# EAGLE schematic SPU_Rev_1.0 (EAGLE 9.3.1)

## Sheet 1 of 4: MCU
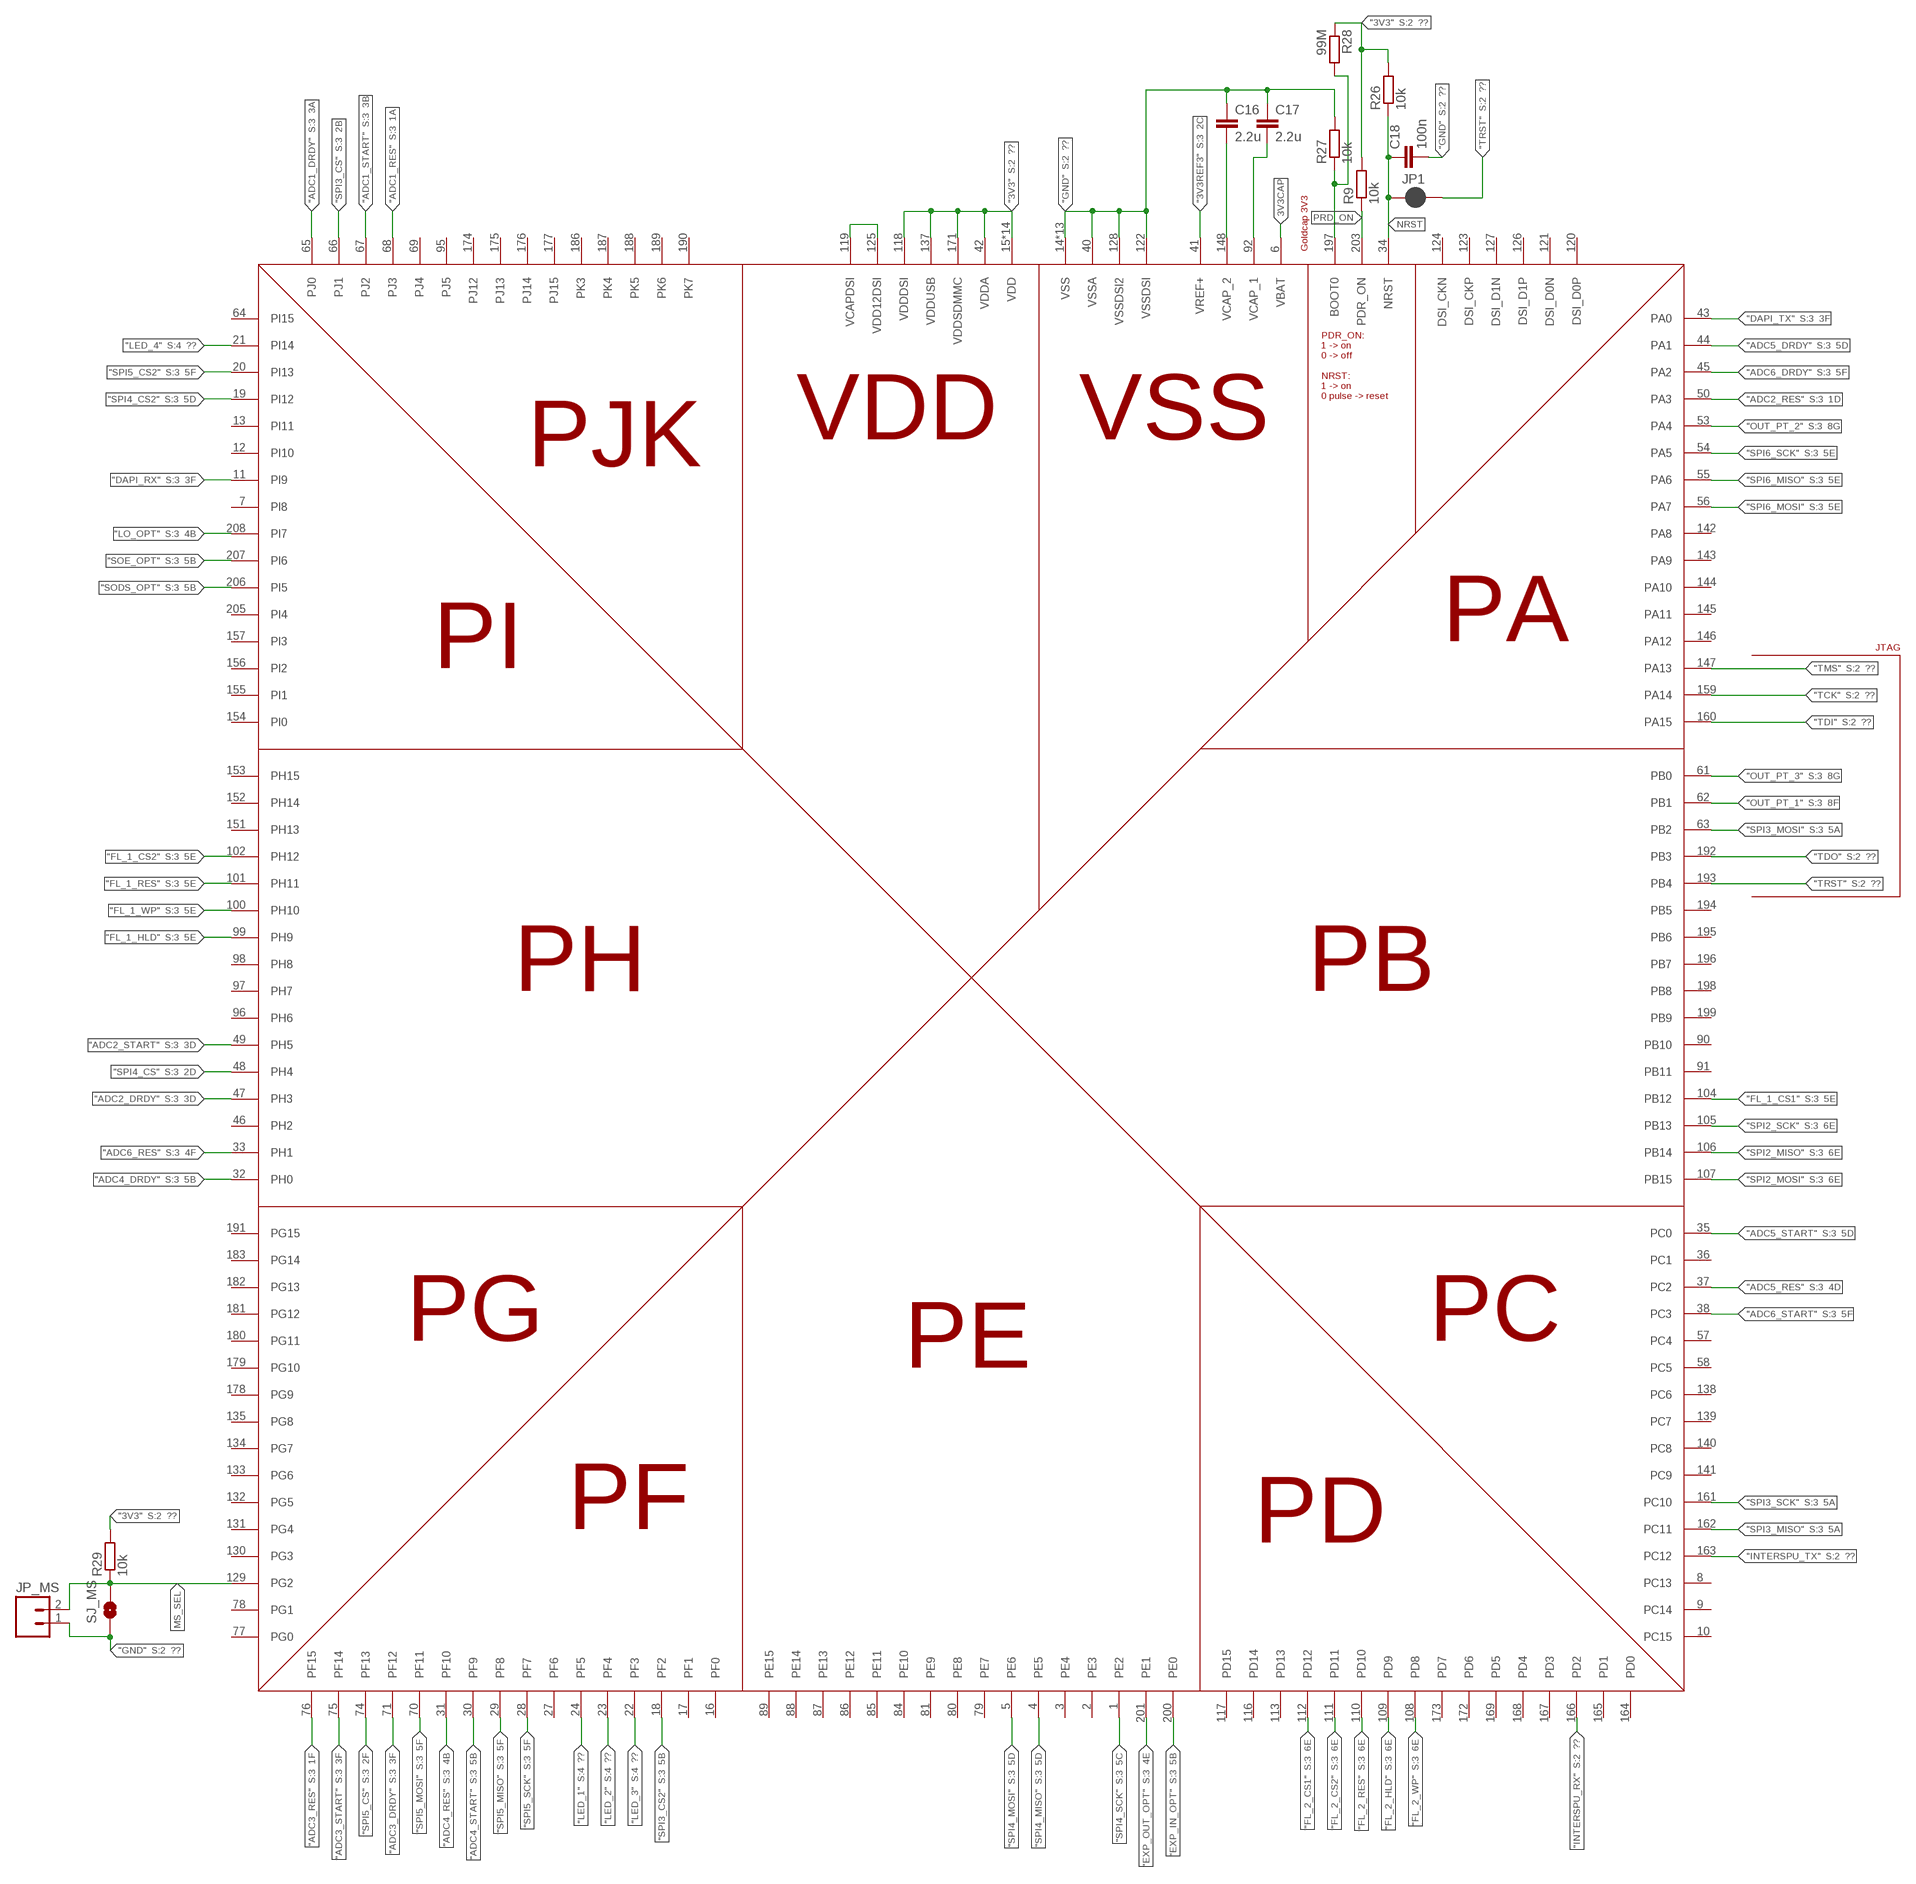
[diagram p0: schematic, sheet 1]

### Parts
C16  2.2u  C-EUC1206  [C1206]
C17  2.2u  C-EUC1206  [C1206]
C18  100n  CAP0603-CAP  [0603-CAP]
JP1  JUMPER-SMT_2_NC_PASTE_SILK  [SMT-JUMPER_2_NC_PASTE_SILK]
JP_MS  M02PTH  [1X02]
R9  10k  R-EU_R0805  [R0805]
R26  10k  R-EU_R0805  [R0805]
R27  10k  R-EU_R0805  [R0805]
R28  99M  R-EU_R0805  [R0805]
R29  10k  R-EU_R0805  [R0805]
SJ_MS  SOLDERJUMPERNO  [SJ_2S-NO]
U9  STM32F77XXXLQFP208  [QFP50P3060X3060X385-208]

### Nets
3V3: R9.2 R26.2 R28.1 R29.2 U9.15(VDD) U9.26(VDD) U9.39(VDD) U9.42(VDDA) U9.52(VDD) U9.59(VDD) U9.73(VDD) U9.83(VDD) U9.94(VDD) U9.103(VDD) U9.115(VDD) U9.118(VDDDSI) U9.137(VDDUSB) U9.150(VDD) U9.158(VDD) U9.171(VDDSDMMC) U9.185(VDD) U9.204(VDD) ; also sheet 2,3,4
3V3CAP: U9.6(VBAT)
3V3REF3: U9.41(VREF+) ; also sheet 3
ADC1_DRDY: U9.65(PJ0) ; also sheet 3
ADC1_RES: U9.68(PJ3) ; also sheet 3
ADC1_START: U9.67(PJ2) ; also sheet 3
ADC2_DRDY: U9.47(PH3) ; also sheet 3
ADC2_RES: U9.50(PA3) ; also sheet 3
ADC2_START: U9.49(PH5) ; also sheet 3
ADC3_DRDY: U9.71(PF12) ; also sheet 3
ADC3_RES: U9.76(PF15) ; also sheet 3
ADC3_START: U9.75(PF14) ; also sheet 3
ADC4_DRDY: U9.32(PH0) ; also sheet 3
ADC4_RES: U9.31(PF10) ; also sheet 3
ADC4_START: U9.30(PF9) ; also sheet 3
ADC5_DRDY: U9.44(PA1) ; also sheet 3
ADC5_RES: U9.37(PC2) ; also sheet 3
ADC5_START: U9.35(PC0) ; also sheet 3
ADC6_DRDY: U9.45(PA2) ; also sheet 3
ADC6_RES: U9.33(PH1) ; also sheet 3
ADC6_START: U9.38(PC3) ; also sheet 3
DAPI_RX: U9.11(PI9) ; also sheet 3
DAPI_TX: U9.43(PA0) ; also sheet 3
EXP_IN_OPT: U9.200(PE0) ; also sheet 3
EXP_OUT_OPT: U9.201(PE1) ; also sheet 3
FL_1_CS1: U9.104(PB12) ; also sheet 3
FL_1_CS2: U9.102(PH12) ; also sheet 3
FL_1_HLD: U9.99(PH9) ; also sheet 3
FL_1_RES: U9.101(PH11) ; also sheet 3
FL_1_WP: U9.100(PH10) ; also sheet 3
FL_2_CS1: U9.112(PD12) ; also sheet 3
FL_2_CS2: U9.111(PD11) ; also sheet 3
FL_2_HLD: U9.109(PD9) ; also sheet 3
FL_2_RES: U9.110(PD10) ; also sheet 3
FL_2_WP: U9.108(PD8) ; also sheet 3
GND: C16.1 C17.1 C18.2 JP_MS.1 R27.2 SJ_MS.1 U9.14(VSS) U9.25(VSS) U9.40(VSSA) U9.51(VSS) U9.60(VSS) U9.72(VSS) U9.82(VSS) U9.93(VSS) U9.114(VSS) U9.122(VSSDSI) U9.128(VSSDSI2) U9.136(VSS) U9.149(VSS) U9.170(VSS) U9.184(VSS) U9.202(VSS) ; also sheet 2,3,4
INTERSPU_RX: U9.166(PD2) ; also sheet 2,3
INTERSPU_TX: U9.163(PC12) ; also sheet 2,3
LED_1: U9.24(PF5) ; also sheet 4
LED_2: U9.23(PF4) ; also sheet 4
LED_3: U9.22(PF3) ; also sheet 4
LED_4: U9.21(PI14) ; also sheet 4
LO_OPT: U9.208(PI7) ; also sheet 3
MS_SEL: JP_MS.2 R29.1 SJ_MS.2 U9.129(PG2)
N$34: C16.2 U9.148(VCAP_2)
N$35: C17.2 U9.92(VCAP_1)
N$36: U9.119(VCAPDSI) U9.125(VDD12DSI)
N$71: R27.1 R28.2 U9.197(BOOT0)
NRST: C18.1 JP1.1 R26.1 U9.34(NRST)
OUT_PT_1: U9.62(PB1) ; also sheet 3
OUT_PT_2: U9.53(PA4) ; also sheet 3
OUT_PT_3: U9.61(PB0) ; also sheet 3
PRD_ON: R9.1 U9.203(PDR_ON)
SODS_OPT: U9.206(PI5) ; also sheet 3
SOE_OPT: U9.207(PI6) ; also sheet 3
SPI2_MISO: U9.106(PB14) ; also sheet 3
SPI2_MOSI: U9.107(PB15) ; also sheet 3
SPI2_SCK: U9.105(PB13) ; also sheet 3
SPI3_CS: U9.66(PJ1) ; also sheet 3
SPI3_CS2: U9.18(PF2) ; also sheet 3
SPI3_MISO: U9.162(PC11) ; also sheet 3
SPI3_MOSI: U9.63(PB2) ; also sheet 3
SPI3_SCK: U9.161(PC10) ; also sheet 3
SPI4_CS: U9.48(PH4) ; also sheet 3
SPI4_CS2: U9.19(PI12) ; also sheet 3
SPI4_MISO: U9.4(PE5) ; also sheet 3
SPI4_MOSI: U9.5(PE6) ; also sheet 3
SPI4_SCK: U9.1(PE2) ; also sheet 3
SPI5_CS: U9.74(PF13) ; also sheet 3
SPI5_CS2: U9.20(PI13) ; also sheet 3
SPI5_MISO: U9.29(PF8) ; also sheet 3
SPI5_MOSI: U9.70(PF11) ; also sheet 3
SPI5_SCK: U9.28(PF7) ; also sheet 3
SPI6_MISO: U9.55(PA6) ; also sheet 3
SPI6_MOSI: U9.56(PA7) ; also sheet 3
SPI6_SCK: U9.54(PA5) ; also sheet 3
TCK: U9.159(PA14) ; also sheet 2
TDI: U9.160(PA15) ; also sheet 2
TDO: U9.192(PB3) ; also sheet 2
TMS: U9.147(PA13) ; also sheet 2
TRST: JP1.2 U9.193(PB4) ; also sheet 2
Unconnected: U9.2(PE3) U9.3(PE4) U9.7(PI8) U9.8(PC13) U9.9(PC14) U9.10(PC15) U9.12(PI10) U9.13(PI11) U9.16(PF0) U9.17(PF1) U9.27(PF6) U9.36(PC1) U9.46(PH2) U9.57(PC4) U9.58(PC5) U9.64(PI15) U9.69(PJ4) U9.77(PG0) U9.78(PG1) U9.79(PE7) U9.80(PE8) U9.81(PE9) U9.84(PE10) U9.85(PE11) U9.86(PE12) U9.87(PE13) U9.88(PE14) U9.89(PE15) U9.90(PB10) U9.91(PB11) U9.95(PJ5) U9.96(PH6) U9.97(PH7) U9.98(PH8) U9.113(PD13) U9.116(PD14) U9.117(PD15) U9.120(DSI_D0P) U9.121(DSI_D0N) U9.123(DSI_CKP) U9.124(DSI_CKN) U9.126(DSI_D1P) U9.127(DSI_D1N) U9.130(PG3) U9.131(PG4) U9.132(PG5) U9.133(PG6) U9.134(PG7) U9.135(PG8) U9.138(PC6) U9.139(PC7) U9.140(PC8) U9.141(PC9) U9.142(PA8) U9.143(PA9) U9.144(PA10) U9.145(PA11) U9.146(PA12) U9.151(PH13) U9.152(PH14) U9.153(PH15) U9.154(PI0) U9.155(PI1) U9.156(PI2) U9.157(PI3) U9.164(PD0) U9.165(PD1) U9.167(PD3) U9.168(PD4) U9.169(PD5) U9.172(PD6) U9.173(PD7) U9.174(PJ12) U9.175(PJ13) U9.176(PJ14) U9.177(PJ15) U9.178(PG9) U9.179(PG10) U9.180(PG11) U9.181(PG12) U9.182(PG13) U9.183(PG14) U9.186(PK3) U9.187(PK4) U9.188(PK5) U9.189(PK6) U9.190(PK7) U9.191(PG15) U9.194(PB5) U9.195(PB6) U9.196(PB7) U9.198(PB8) U9.199(PB9) U9.205(PI4)

### Notes on the sheet
- Goldcap 3V3
- PDR_ON:
  1 -> on
  0 -> off
  
  NRST:
  1 -> on
  0 pulse -> reset
- JTAG

## Sheet 2 of 4: Connectors
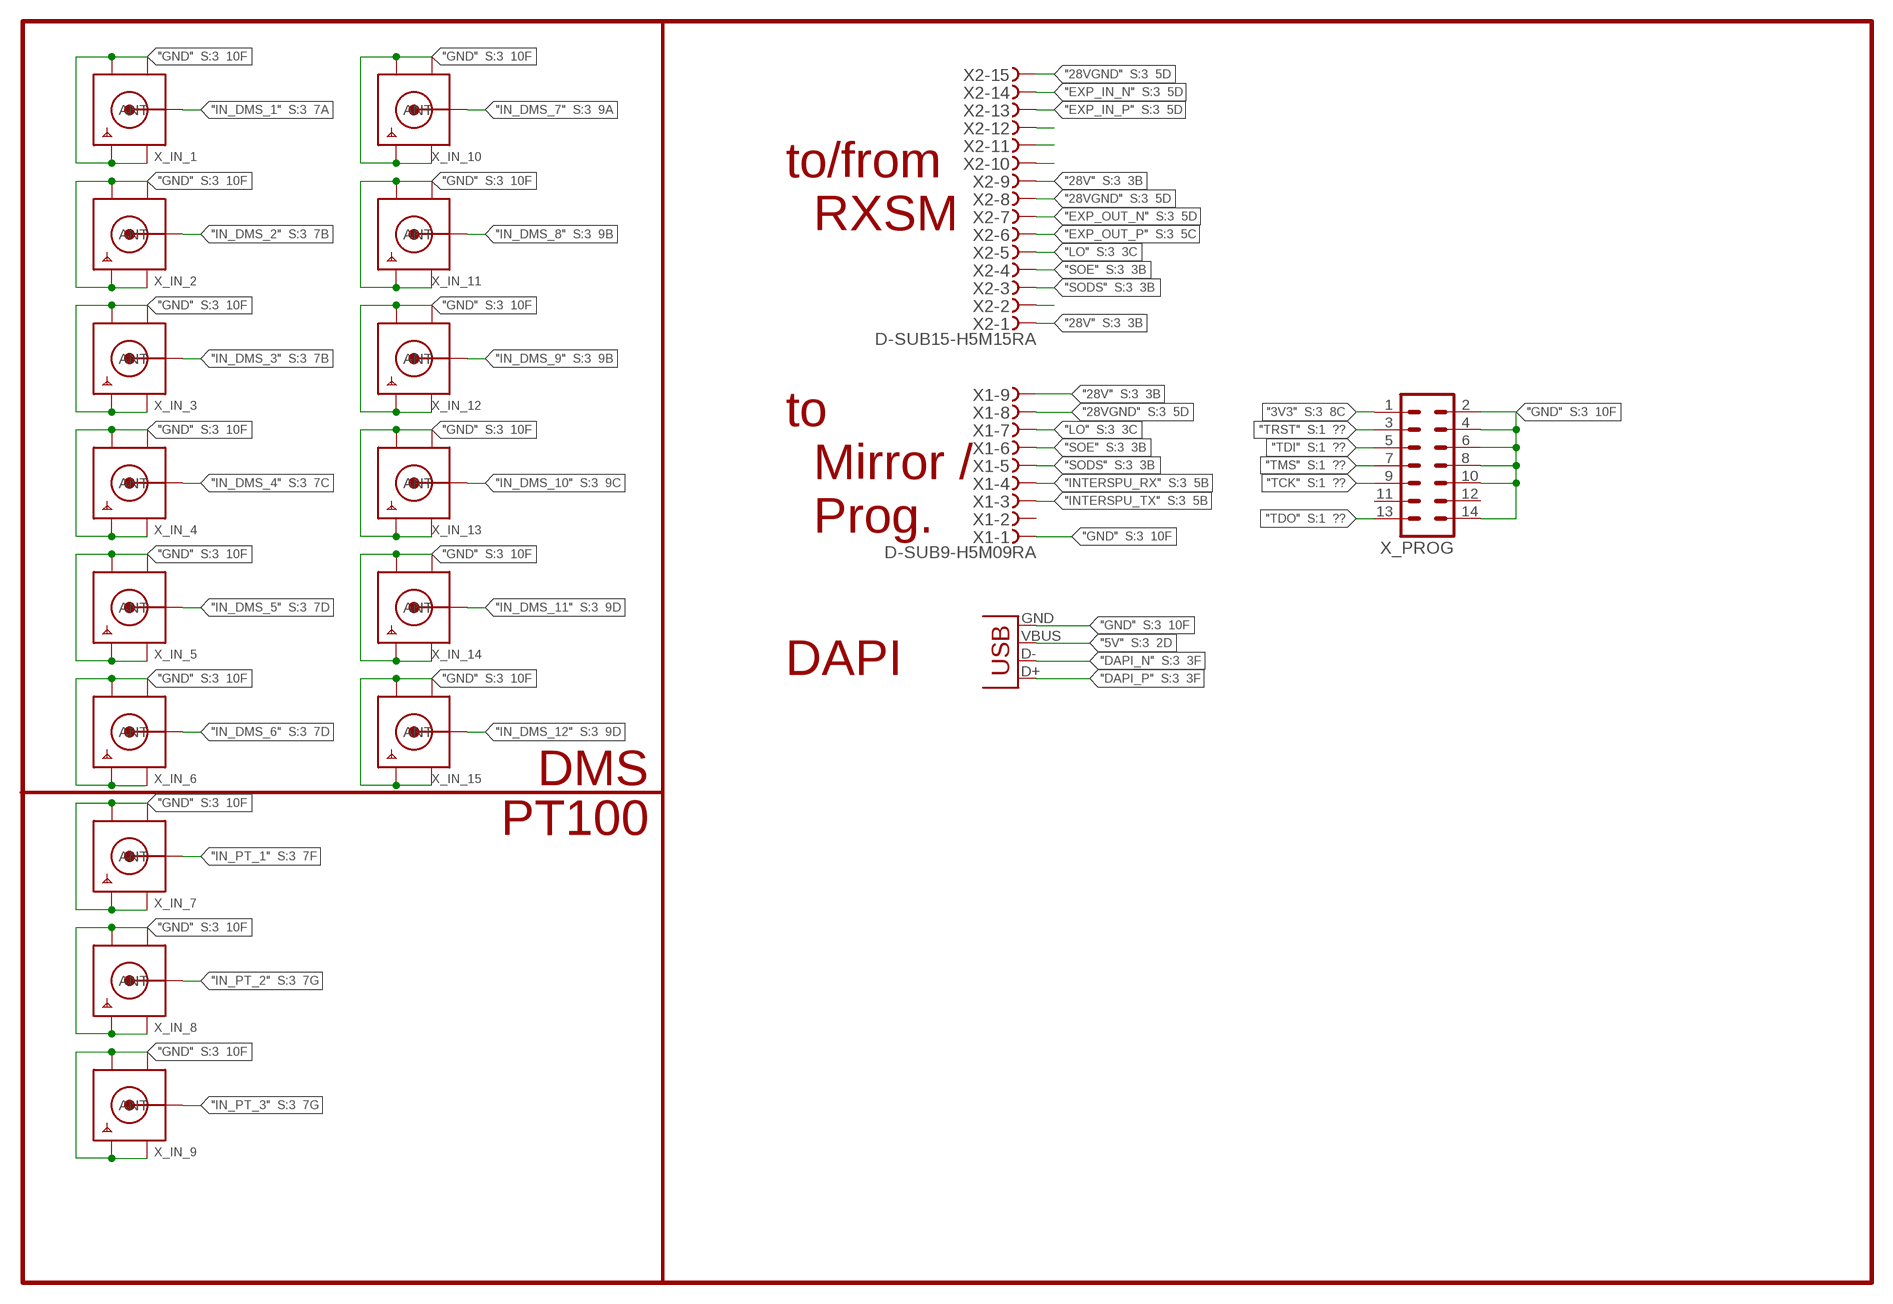
[diagram p1: schematic, sheet 2]

### Parts
X1  D-SUB9-H5M09RA  [H5M09RA]
X2  D-SUB15-H5M15RA  [H5M15RA]
X3  USBPTH  [USB-B-PTH]
X_IN_1  SMACONNECTOR_EDGE  [SMA_EDGELAUNCH]
X_IN_2  SMACONNECTOR_EDGE  [SMA_EDGELAUNCH]
X_IN_3  SMACONNECTOR_EDGE  [SMA_EDGELAUNCH]
X_IN_4  SMACONNECTOR_EDGE  [SMA_EDGELAUNCH]
X_IN_5  SMACONNECTOR_EDGE  [SMA_EDGELAUNCH]
X_IN_6  SMACONNECTOR_EDGE  [SMA_EDGELAUNCH]
X_IN_7  SMACONNECTOR_EDGE  [SMA_EDGELAUNCH]
X_IN_8  SMACONNECTOR_EDGE  [SMA_EDGELAUNCH]
X_IN_9  SMACONNECTOR_EDGE  [SMA_EDGELAUNCH]
X_IN_10  SMACONNECTOR_EDGE  [SMA_EDGELAUNCH]
X_IN_11  SMACONNECTOR_EDGE  [SMA_EDGELAUNCH]
X_IN_12  SMACONNECTOR_EDGE  [SMA_EDGELAUNCH]
X_IN_13  SMACONNECTOR_EDGE  [SMA_EDGELAUNCH]
X_IN_14  SMACONNECTOR_EDGE  [SMA_EDGELAUNCH]
X_IN_15  SMACONNECTOR_EDGE  [SMA_EDGELAUNCH]
X_PROG  MA07-2  [MA07-2]

### Nets
3V3: X_PROG.1 ; also sheet 1,3,4
5V: X3.VBUS ; also sheet 3,4
28V: X1.9 X2.1 X2.9 ; also sheet 3,4
28VGND: X1.8 X2.8 X2.15 ; also sheet 3,4
DAPI_N: X3.D- ; also sheet 3
DAPI_P: X3.D+ ; also sheet 3
EXP_IN_N: X2.14 ; also sheet 3
EXP_IN_P: X2.13 ; also sheet 3
EXP_OUT_N: X2.7 ; also sheet 3
EXP_OUT_P: X2.6 ; also sheet 3
GND: X1.1 X3.GND X_IN_1.GND@1(GND4) X_IN_1.GND@2(GND3) X_IN_1.GND@3(GND2) X_IN_1.GND@4(GND1) X_IN_2.GND@1(GND4) X_IN_2.GND@2(GND3) X_IN_2.GND@3(GND2) X_IN_2.GND@4(GND1) X_IN_3.GND@1(GND4) X_IN_3.GND@2(GND3) X_IN_3.GND@3(GND2) X_IN_3.GND@4(GND1) X_IN_4.GND@1(GND4) X_IN_4.GND@2(GND3) X_IN_4.GND@3(GND2) X_IN_4.GND@4(GND1) X_IN_5.GND@1(GND4) X_IN_5.GND@2(GND3) X_IN_5.GND@3(GND2) X_IN_5.GND@4(GND1) X_IN_6.GND@1(GND4) X_IN_6.GND@2(GND3) X_IN_6.GND@3(GND2) X_IN_6.GND@4(GND1) X_IN_7.GND@1(GND4) X_IN_7.GND@2(GND3) X_IN_7.GND@3(GND2) X_IN_7.GND@4(GND1) X_IN_8.GND@1(GND4) X_IN_8.GND@2(GND3) X_IN_8.GND@3(GND2) X_IN_8.GND@4(GND1) X_IN_9.GND@1(GND4) X_IN_9.GND@2(GND3) X_IN_9.GND@3(GND2) X_IN_9.GND@4(GND1) X_IN_10.GND@1(GND4) X_IN_10.GND@2(GND3) X_IN_10.GND@3(GND2) X_IN_10.GND@4(GND1) X_IN_11.GND@1(GND4) X_IN_11.GND@2(GND3) X_IN_11.GND@3(GND2) X_IN_11.GND@4(GND1) X_IN_12.GND@1(GND4) X_IN_12.GND@2(GND3) X_IN_12.GND@3(GND2) X_IN_12.GND@4(GND1) X_IN_13.GND@1(GND4) X_IN_13.GND@2(GND3) X_IN_13.GND@3(GND2) X_IN_13.GND@4(GND1) X_IN_14.GND@1(GND4) X_IN_14.GND@2(GND3) X_IN_14.GND@3(GND2) X_IN_14.GND@4(GND1) X_IN_15.GND@1(GND4) X_IN_15.GND@2(GND3) X_IN_15.GND@3(GND2) X_IN_15.GND@4(GND1) X_PROG.2 X_PROG.4 X_PROG.6 X_PROG.8 X_PROG.10 X_PROG.14 ; also sheet 1,3,4
IN_DMS_1: X_IN_1.P(ANT) ; also sheet 3
IN_DMS_2: X_IN_2.P(ANT) ; also sheet 3
IN_DMS_3: X_IN_3.P(ANT) ; also sheet 3
IN_DMS_4: X_IN_4.P(ANT) ; also sheet 3
IN_DMS_5: X_IN_5.P(ANT) ; also sheet 3
IN_DMS_6: X_IN_6.P(ANT) ; also sheet 3
IN_DMS_7: X_IN_10.P(ANT) ; also sheet 3
IN_DMS_8: X_IN_11.P(ANT) ; also sheet 3
IN_DMS_9: X_IN_12.P(ANT) ; also sheet 3
IN_DMS_10: X_IN_13.P(ANT) ; also sheet 3
IN_DMS_11: X_IN_14.P(ANT) ; also sheet 3
IN_DMS_12: X_IN_15.P(ANT) ; also sheet 3
IN_PT_1: X_IN_7.P(ANT) ; also sheet 3
IN_PT_2: X_IN_8.P(ANT) ; also sheet 3
IN_PT_3: X_IN_9.P(ANT) ; also sheet 3
INTERSPU_RX: X1.4 ; also sheet 1,3
INTERSPU_TX: X1.3 ; also sheet 1,3
LO: X1.7 X2.5 ; also sheet 3
N$2: X2.2
N$10: X2.10
N$11: X2.11
N$12: X2.12
SODS: X1.5 X2.3 ; also sheet 3
SOE: X1.6 X2.4 ; also sheet 3
TCK: X_PROG.9 ; also sheet 1
TDI: X_PROG.5 ; also sheet 1
TDO: X_PROG.13 ; also sheet 1
TMS: X_PROG.7 ; also sheet 1
TRST: X_PROG.3 ; also sheet 1
Unconnected: X1.2 X_PROG.11 X_PROG.12

### Notes on the sheet
- to/from
    RXSM
- to 
    Mirror /
    Prog.
- DAPI
- DMS
- PT100

## Sheet 3 of 4: IC
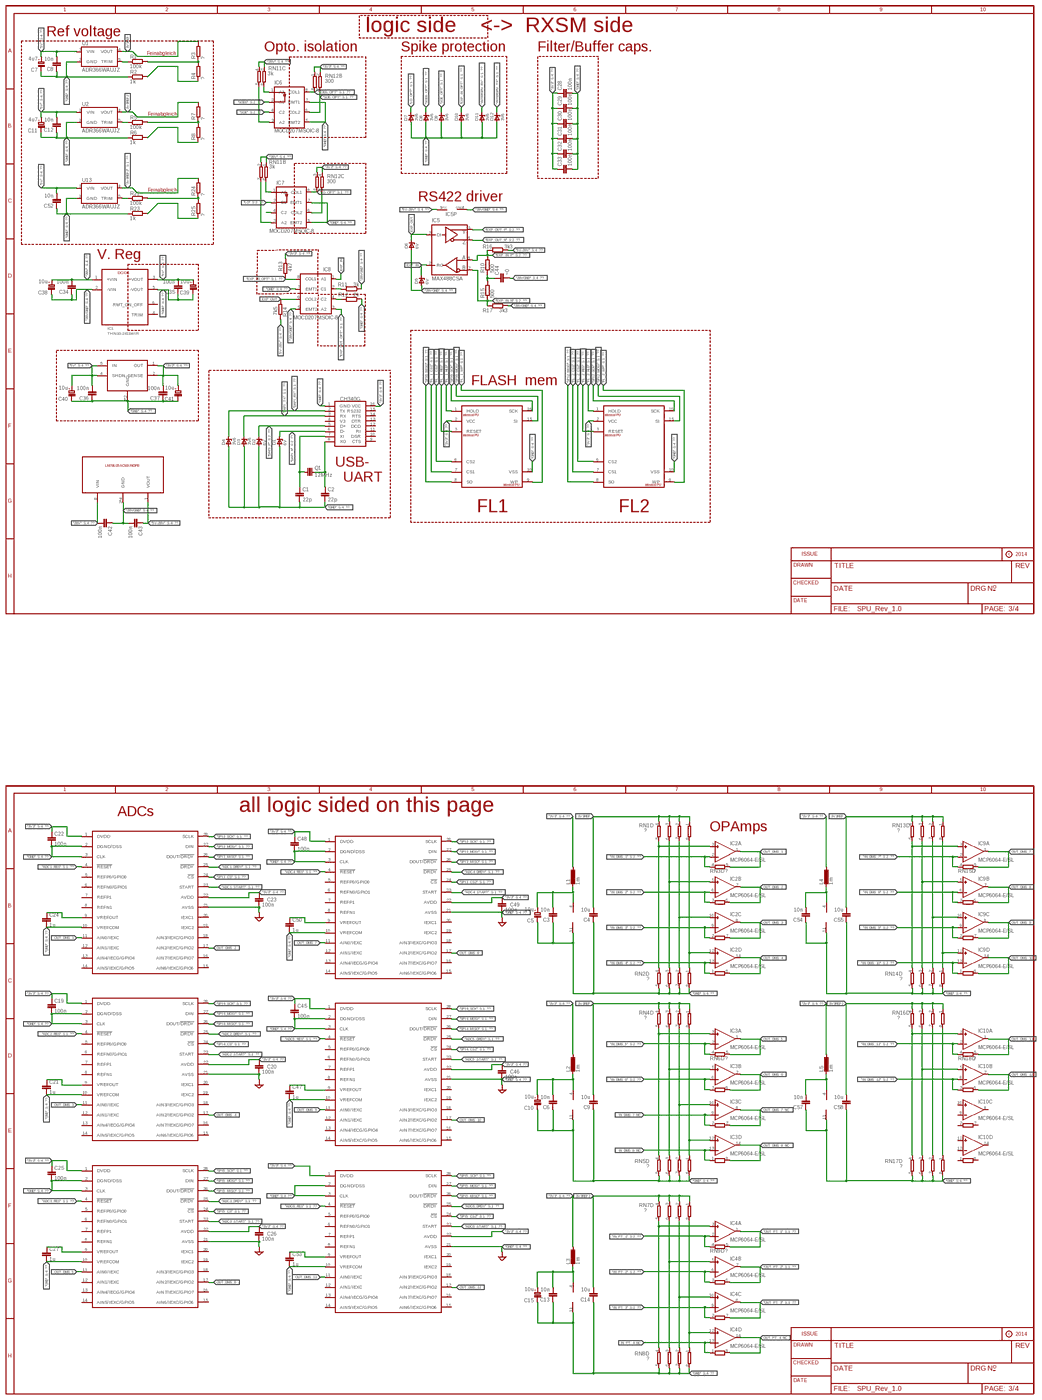
[diagram p2: schematic, sheet 3, overview]
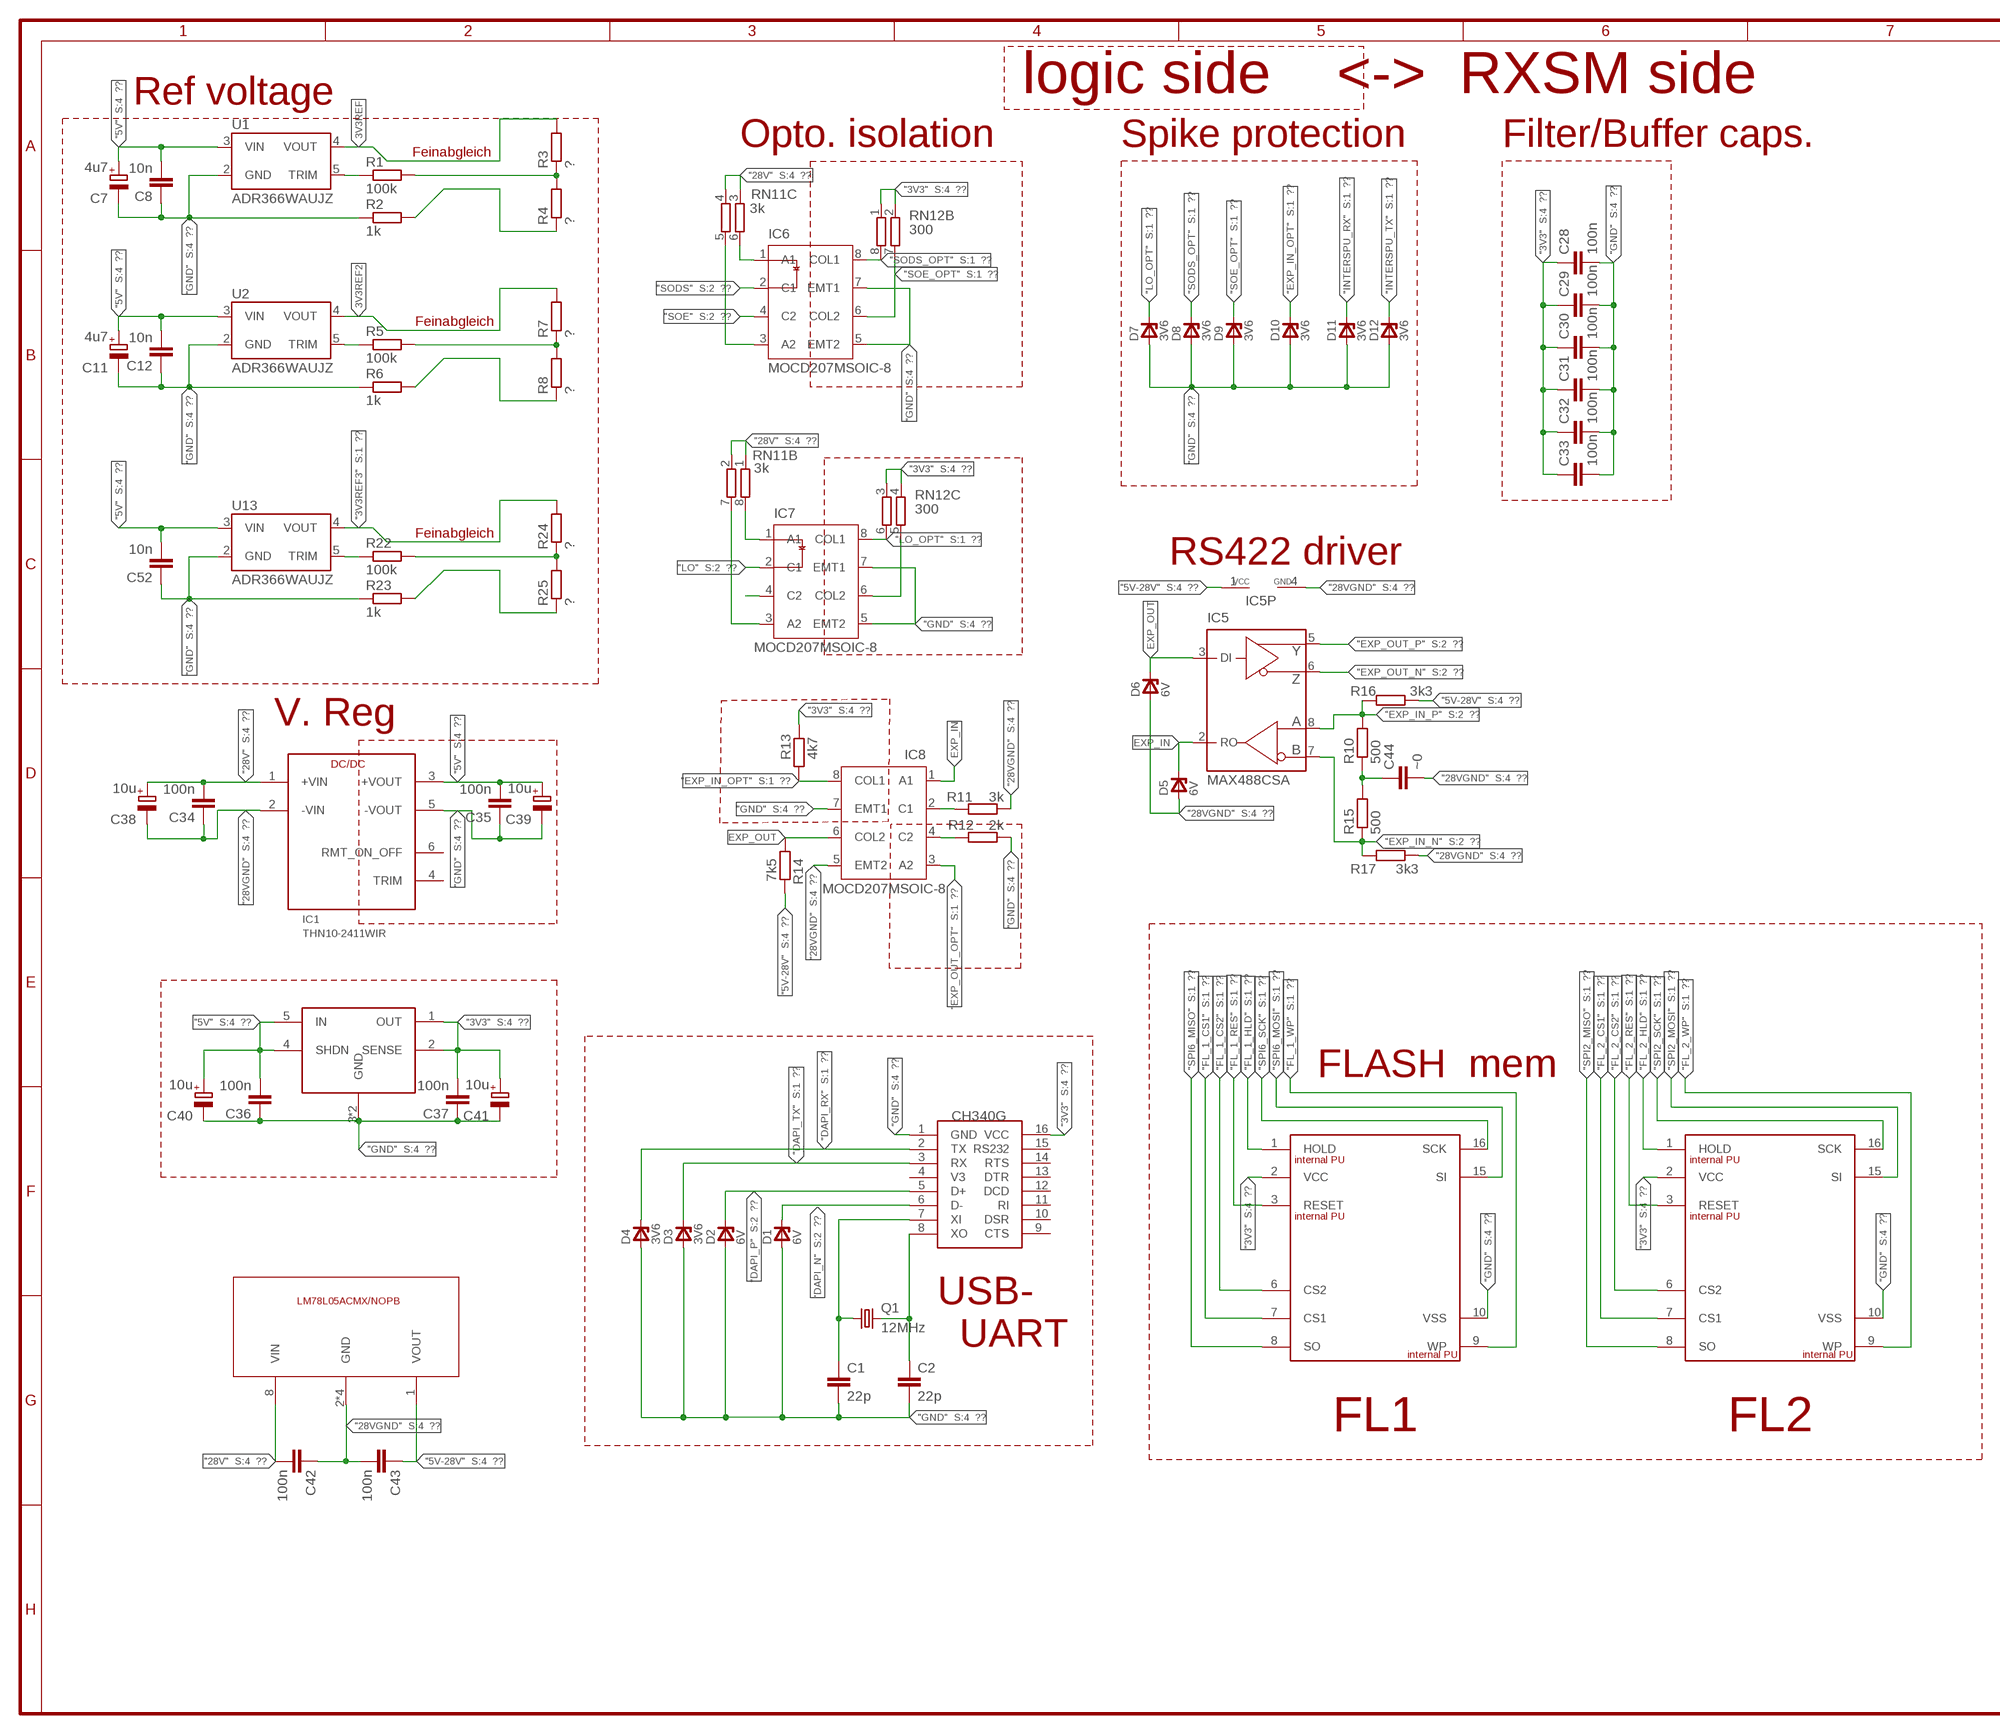
[diagram p3: schematic, sheet 3, part 1 of 4]
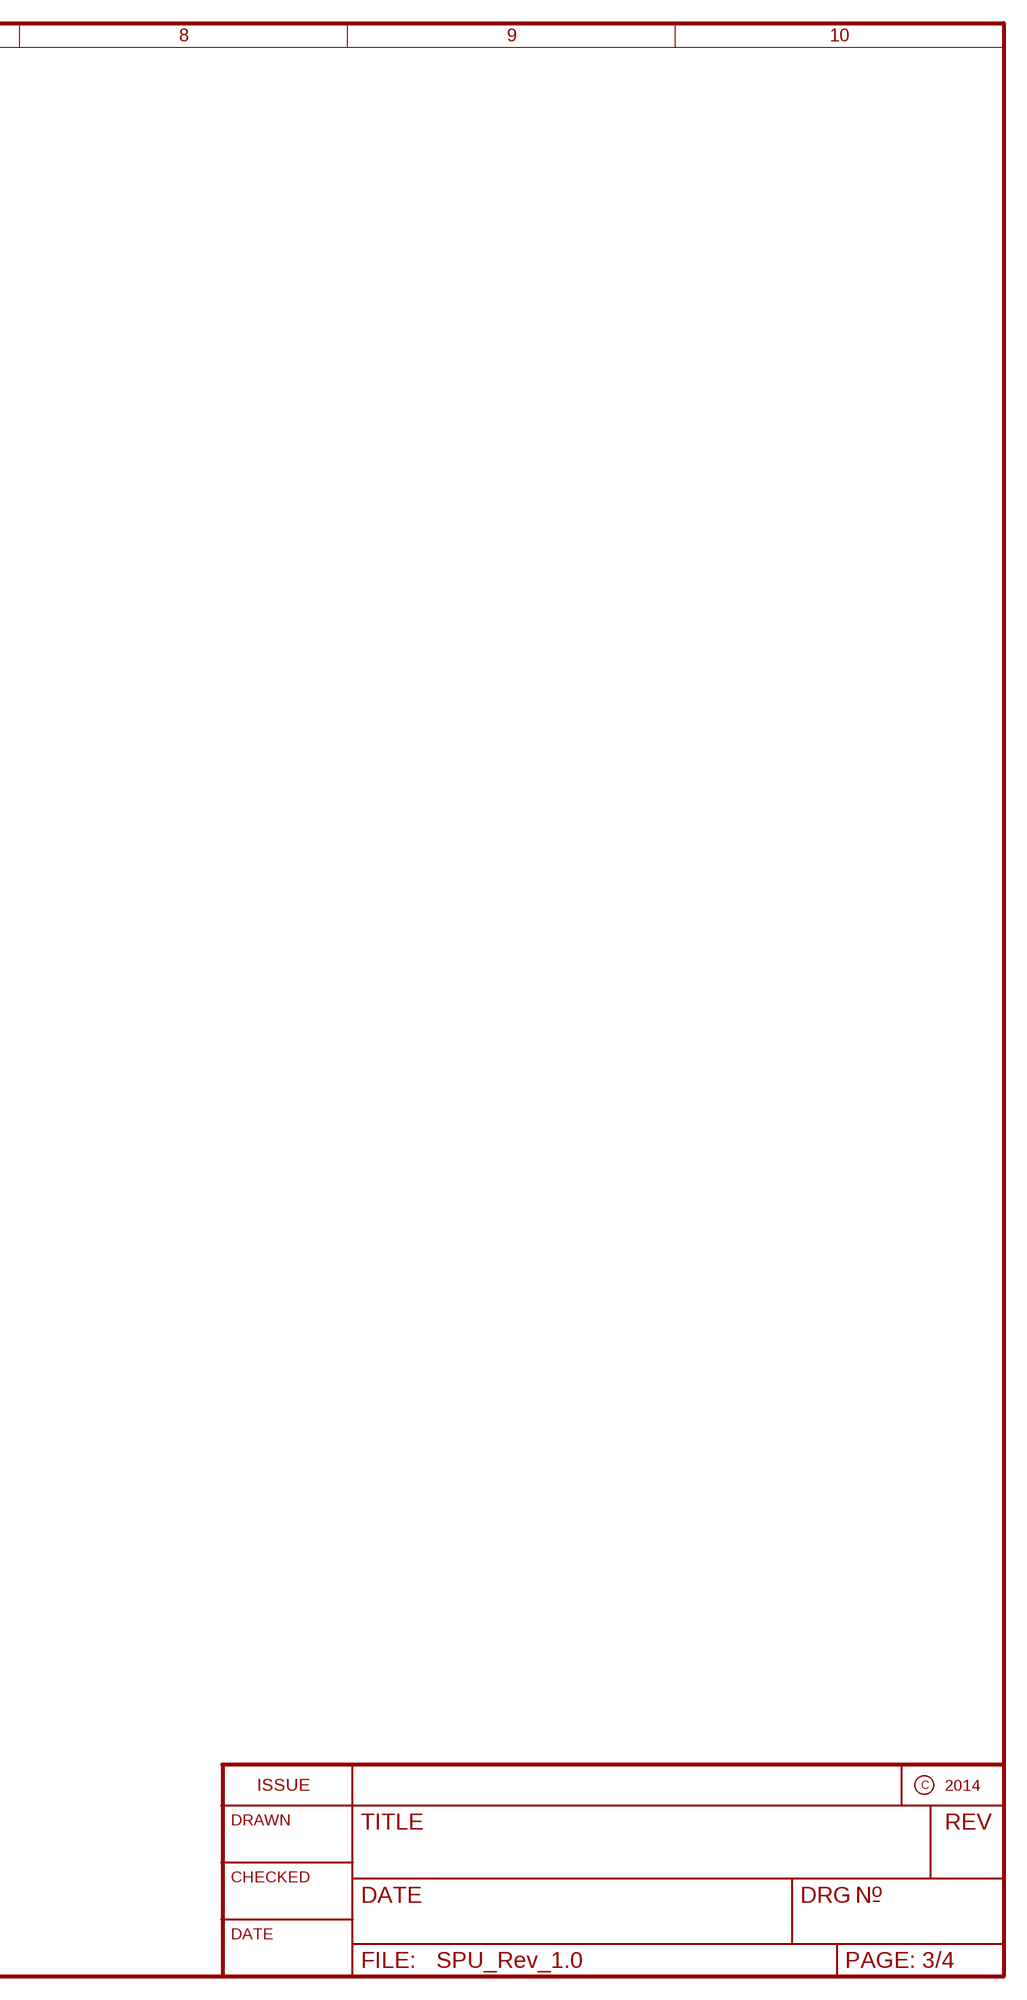
[diagram p4: schematic, sheet 3, part 2 of 4]
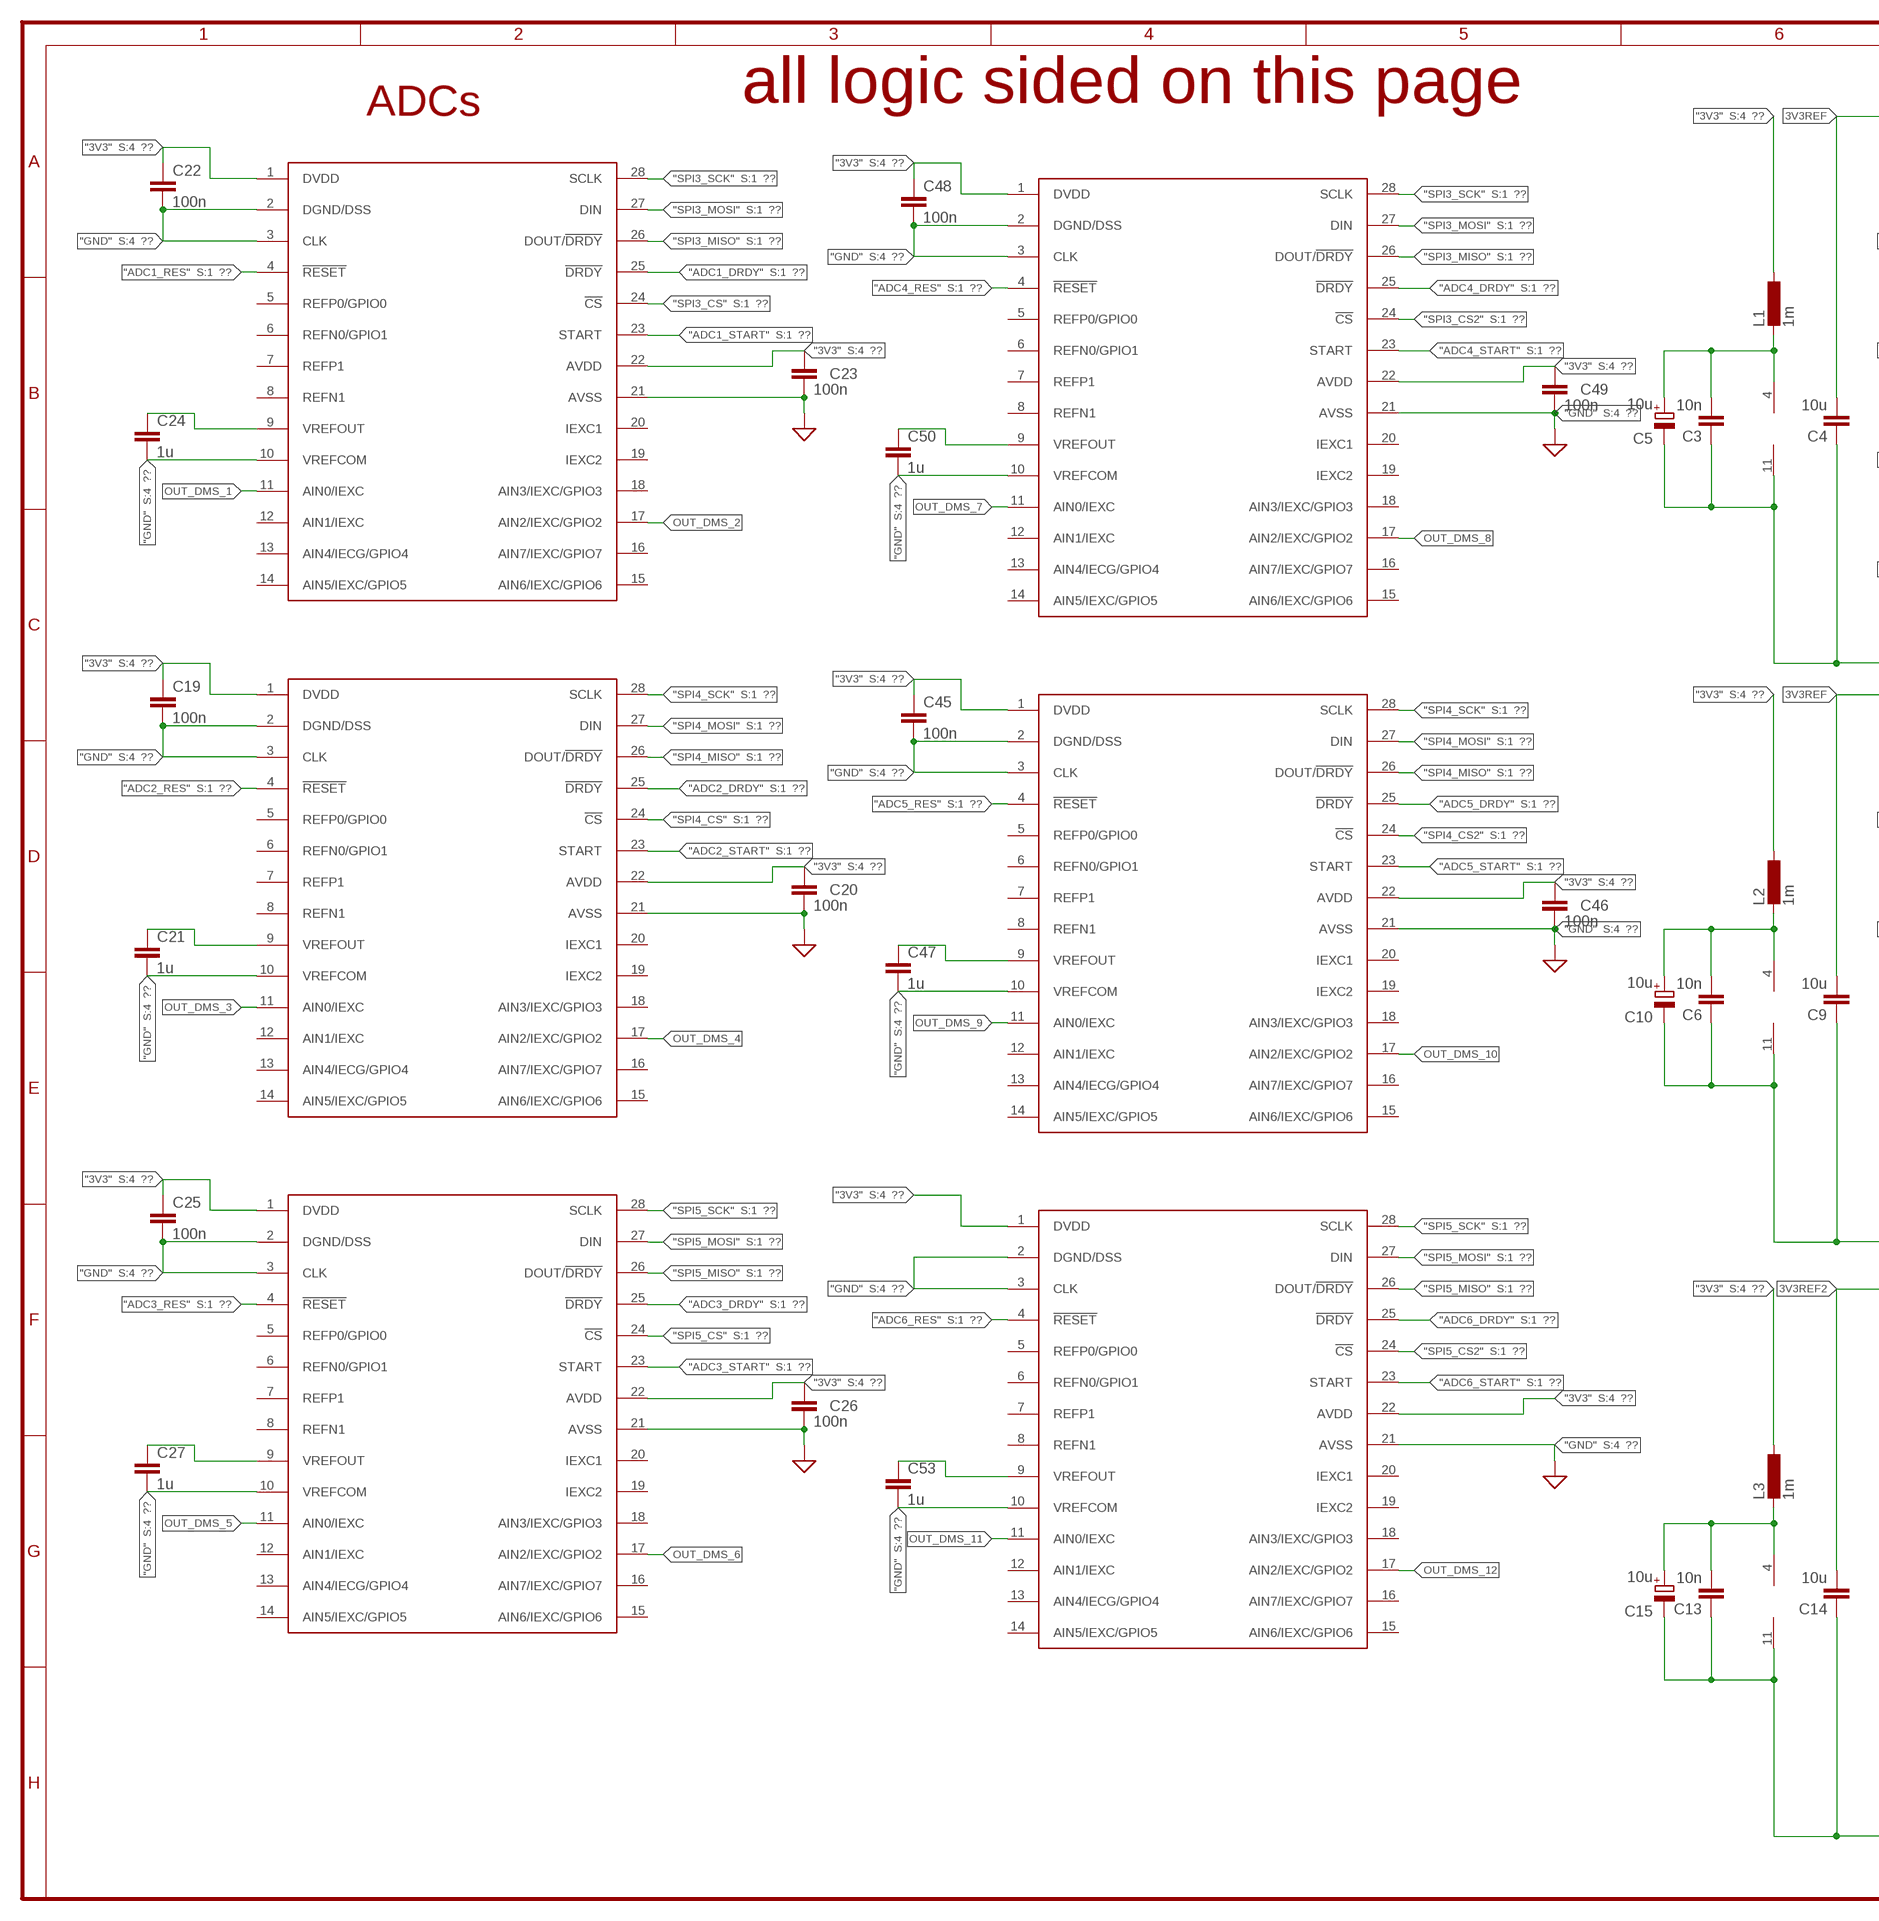
[diagram p5: schematic, sheet 3, part 3 of 4]
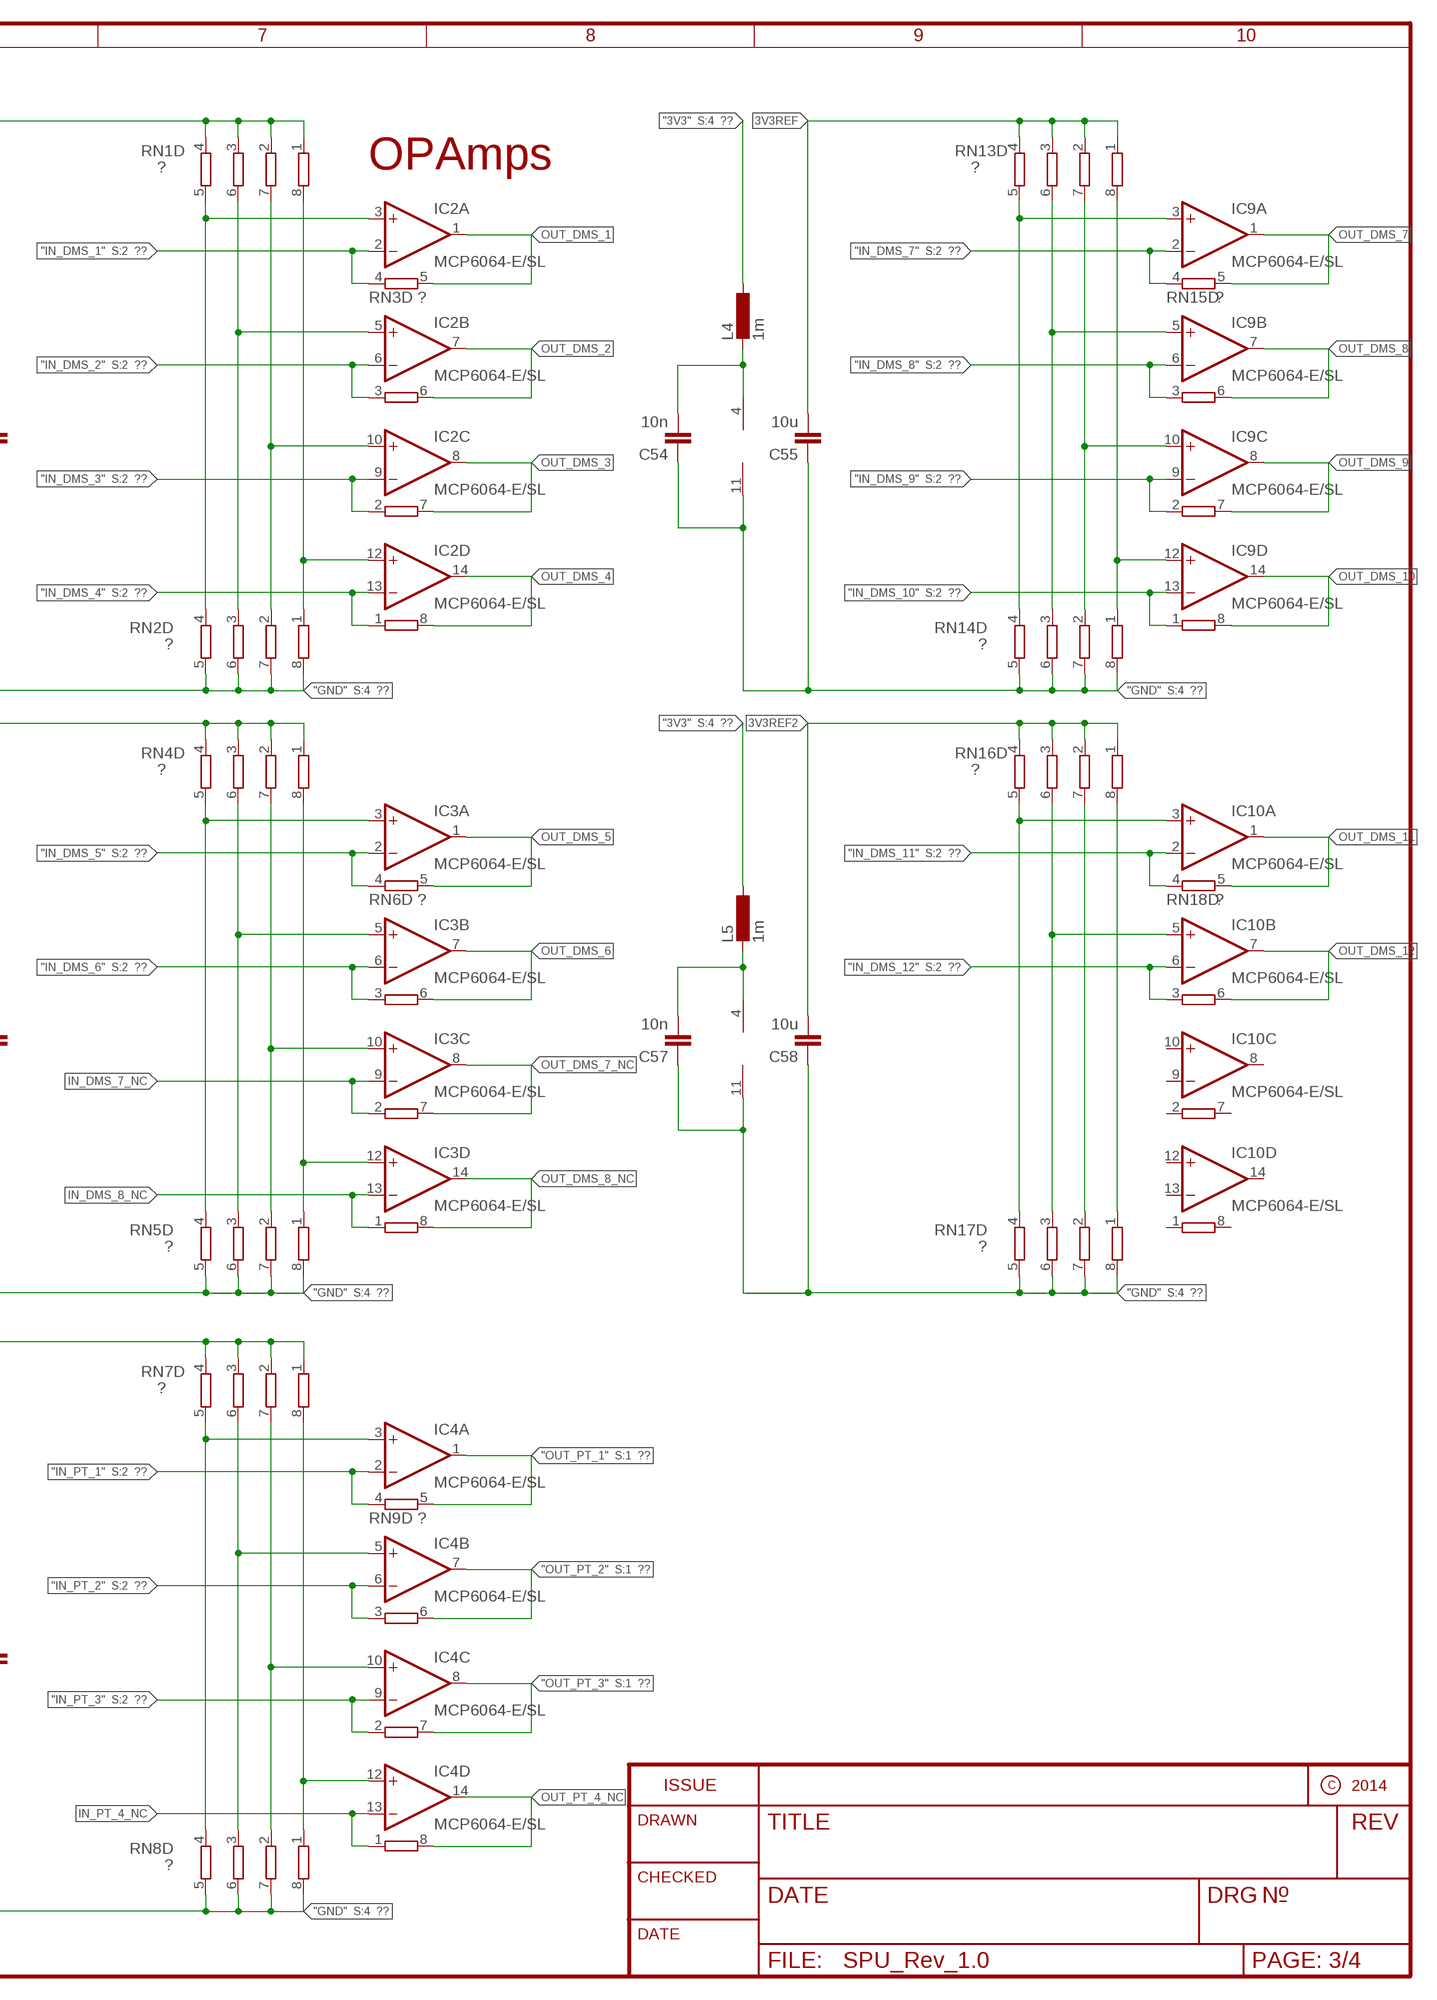
[diagram p6: schematic, sheet 3, part 4 of 4]

### Parts
C1  22p  C-EUC0603  [C0603]
C2  22p  C-EUC0603  [C0603]
C3  10n  C-EUC0805  [C0805]
C4  10u  C-EUC0805  [C0805]
C5  10u  CPOL-EU153CLV-0810  [153CLV-0810]
C6  10n  C-EUC0805  [C0805]
C7  4u7  CPOL-EU153CLV-0810  [153CLV-0810]
C8  10n  C-EUC0805  [C0805]
C9  10u  C-EUC0805  [C0805]
C10  10u  CPOL-EU153CLV-0810  [153CLV-0810]
C11  4u7  CPOL-EU153CLV-0810  [153CLV-0810]
C12  10n  C-EUC0805  [C0805]
C13  10n  C-EUC0805  [C0805]
C14  10u  C-EUC0805  [C0805]
C15  10u  CPOL-EU153CLV-0810  [153CLV-0810]
C19  100n  C-EUC0805  [C0805]
C20  100n  C-EUC0805  [C0805]
C21  1u  C-EUC0805  [C0805]
C22  100n  C-EUC0805  [C0805]
C23  100n  C-EUC0805  [C0805]
C24  1u  C-EUC0805  [C0805]
C25  100n  C-EUC0805  [C0805]
C26  100n  C-EUC0805  [C0805]
C27  1u  C-EUC0805  [C0805]
C28  100n  C-EUC0805  [C0805]
C29  100n  C-EUC0805  [C0805]
C30  100n  C-EUC0805  [C0805]
C31  100n  C-EUC0805  [C0805]
C32  100n  C-EUC0805  [C0805]
C33  100n  C-EUC0805  [C0805]
C34  100n  C-EUC0805  [C0805]
C35  100n  C-EUC0805  [C0805]
C36  100n  C-EUC0805  [C0805]
C37  100n  C-EUC0805  [C0805]
C38  10u  CPOL-EU153CLV-0810  [153CLV-0810]
C39  10u  CPOL-EU153CLV-0810  [153CLV-0810]
C40  10u  CPOL-EU153CLV-0810  [153CLV-0810]
C41  10u  CPOL-EU153CLV-0810  [153CLV-0810]
C42  100n  C-EUC0805  [C0805]
C43  100n  C-EUC0805  [C0805]
C44  ~0  C-EUC0805  [C0805]
C45  100n  C-EUC0805  [C0805]
C46  100n  C-EUC0805  [C0805]
C47  1u  C-EUC0805  [C0805]
C48  100n  C-EUC0805  [C0805]
C49  100n  C-EUC0805  [C0805]
C50  1u  C-EUC0805  [C0805]
C52  10n  C-EUC0805  [C0805]
C53  1u  C-EUC0805  [C0805]
C54  10n  C-EUC0805  [C0805]
C55  10u  C-EUC0805  [C0805]
C57  10n  C-EUC0805  [C0805]
C58  10u  C-EUC0805  [C0805]
D1  6V  DZMELF  [DMELF]
D2  6V  DZMELF  [DMELF]
D3  3V6  DZMELF  [DMELF]
D4  3V6  DZMELF  [DMELF]
D5  6V  DZMELF  [DMELF]
D6  6V  DZMELF  [DMELF]
D7  3V6  DZMELF  [DMELF]
D8  3V6  DZMELF  [DMELF]
D9  3V6  DZMELF  [DMELF]
D10  3V6  DZMELF  [DMELF]
D11  3V6  DZMELF  [DMELF]
D12  3V6  DZMELF  [DMELF]
IC1  THN10-2411WIR  THL_20WI_SERIES  [THL_20WI_SERIES]
IC2  MCP6064-E/SL  MCP604SL  [SO14]
IC3  MCP6064-E/SL  MCP604SL  [SO14]
IC4  MCP6064-E/SL  MCP604SL  [SO14]
IC5  MAX488CSA  [SO08]
IC6  MOCD207MSOIC-8  [SOIC127P594X363-8N]
IC7  MOCD207MSOIC-8  [SOIC127P594X363-8N]
IC8  MOCD207MSOIC-8  [SOIC127P594X363-8N]
IC9  MCP6064-E/SL  MCP604SL  [SO14]
IC10  MCP6064-E/SL  MCP604SL  [SO14]
IC12  LM78L05ACMX/NOPB  [SOIC8]
IC13  CH340G  [SOIC16]
L1  1m  L-EUL5650M  [L5650M]
L2  1m  L-EUL5650M  [L5650M]
L3  1m  L-EUL5650M  [L5650M]
L4  1m  L-EUL5650M  [L5650M]
L5  1m  L-EUL5650M  [L5650M]
Q1  12MHz  CRYSTALSM49  [SM49]
R1  100k  R-EU_R0805  [R0805]
R2  1k  R-EU_R0805  [R0805]
R3  ?  R-EU_R0805  [R0805]
R4  ?  R-EU_R0805  [R0805]
R5  100k  R-EU_R0805  [R0805]
R6  1k  R-EU_R0805  [R0805]
R7  ?  R-EU_R0805  [R0805]
R8  ?  R-EU_R0805  [R0805]
R10  500  R-EU_R0805  [R0805]
R11  3k  R-EU_R0805  [R0805]
R12  2k  R-EU_R0805  [R0805]
R13  4k7  R-EU_R0805  [R0805]
R14  7k5  R-EU_R0805  [R0805]
R15  500  R-EU_R0805  [R0805]
R16  3k3  R-EU_R0805  [R0805]
R17  3k3  R-EU_R0805  [R0805]
R22  100k  R-EU_R0805  [R0805]
R23  1k  R-EU_R0805  [R0805]
R24  ?  R-EU_R0805  [R0805]
R25  ?  R-EU_R0805  [R0805]
RN1  ?  4R-NEXBS8V  [EXBS8V]
RN2  ?  4R-NEXBS8V  [EXBS8V]
RN3  ?  4R-NEXBS8V  [EXBS8V]
RN4  ?  4R-NEXBS8V  [EXBS8V]
RN5  ?  4R-NEXBS8V  [EXBS8V]
RN6  ?  4R-NEXBS8V  [EXBS8V]
RN7  ?  4R-NEXBS8V  [EXBS8V]
RN8  ?  4R-NEXBS8V  [EXBS8V]
RN9  ?  4R-NEXBS8V  [EXBS8V]
RN11  3k  4R-NEXBS8V  [EXBS8V]
RN12  300  4R-NEXBS8V  [EXBS8V]
RN13  ?  4R-NEXBS8V  [EXBS8V]
RN14  ?  4R-NEXBS8V  [EXBS8V]
RN15  ?  4R-NEXBS8V  [EXBS8V]
RN16  ?  4R-NEXBS8V  [EXBS8V]
RN17  ?  4R-NEXBS8V  [EXBS8V]
RN18  ?  4R-NEXBS8V  [EXBS8V]
U1  ADR366WAUJZ  ADR36_UJZ  [SOT23-5]
U2  ADR366WAUJZ  ADR36_UJZ  [SOT23-5]
U3  ADS1148QPWRQ1  [TSSOP28]
U4  ADS1148QPWRQ1  [TSSOP28]
U5  ADS1148QPWRQ1  [TSSOP28]
U6  LT1528  [Q5-DD]
U7  S70FL01GS  [SO16]
U8  S70FL01GS  [SO16]
U10  ADS1148QPWRQ1  [TSSOP28]
U11  ADS1148QPWRQ1  [TSSOP28]
U12  ADS1148QPWRQ1  [TSSOP28]
U13  ADR366WAUJZ  ADR36_UJZ  [SOT23-5]

### Nets
3V3: C19.1 C20.1 C22.1 C23.1 C25.1 C26.1 C28.1 C29.1 C30.1 C31.1 C32.1 C33.1 C37.2 C41.+ C45.1 C46.1 C48.1 C49.1 IC13.16(VCC) L1.1 L2.1 L3.1 L4.1 L5.1 R13.2 RN12.1 RN12.2 RN12.3 RN12.4 U3.1(DVDD) U3.22(AVDD) U4.1(DVDD) U4.22(AVDD) U5.1(DVDD) U5.22(AVDD) U6.1(OUT) U6.2(SENSE) U7.2(VCC) U8.2(VCC) U10.1(DVDD) U10.22(AVDD) U11.1(DVDD) U11.22(AVDD) U12.1(DVDD) U12.22(AVDD) ; also sheet 1,2,4
3V3REF: C4.2 C9.2 C55.2 R3.2 RN1.1 RN1.2 RN1.3 RN1.4 RN4.1 RN4.2 RN4.3 RN4.4 RN13.1 RN13.2 RN13.3 RN13.4 U1.4(VOUT)
3V3REF2: C14.2 C58.2 R7.2 RN7.1 RN7.2 RN7.3 RN7.4 RN16.1 RN16.2 RN16.3 RN16.4 U2.4(VOUT)
3V3REF3: R24.2 U13.4(VOUT) ; also sheet 1
5V: C7.+ C8.2 C11.+ C12.2 C35.2 C36.2 C39.+ C40.+ C52.2 IC1.3(+VOUT) U1.3(VIN) U2.3(VIN) U6.4(SHDN) U6.5(IN) U13.3(VIN) ; also sheet 2,4
5V-28V: C43.1 IC5.1(VCC) IC12.1(VOUT) R14.2 R16.1 ; also sheet 4
28V: C34.2 C38.+ C42.2 IC1.1(+VIN) IC12.8(VIN) RN11.1 RN11.2 RN11.3 RN11.4 ; also sheet 2,4
28VGND: C34.1 C38.- C42.1 C43.2 C44.2 D5.A D6.A IC1.2(-VIN) IC5.4(GND) IC8.5(EMT2) IC12.2(GND) IC12.3(GND) IC12.6(GND) IC12.7(GND) R11.1 R17.1 ; also sheet 2,4
ADC1_DRDY: U4.25(!DRDY) ; also sheet 1
ADC1_RES: U4.4(!RESET) ; also sheet 1
ADC1_START: U4.23(START) ; also sheet 1
ADC2_DRDY: U3.25(!DRDY) ; also sheet 1
ADC2_RES: U3.4(!RESET) ; also sheet 1
ADC2_START: U3.23(START) ; also sheet 1
ADC3_DRDY: U5.25(!DRDY) ; also sheet 1
ADC3_RES: U5.4(!RESET) ; also sheet 1
ADC3_START: U5.23(START) ; also sheet 1
ADC4_DRDY: U11.25(!DRDY) ; also sheet 1
ADC4_RES: U11.4(!RESET) ; also sheet 1
ADC4_START: U11.23(START) ; also sheet 1
ADC5_DRDY: U10.25(!DRDY) ; also sheet 1
ADC5_RES: U10.4(!RESET) ; also sheet 1
ADC5_START: U10.23(START) ; also sheet 1
ADC6_DRDY: U12.25(!DRDY) ; also sheet 1
ADC6_RES: U12.4(!RESET) ; also sheet 1
ADC6_START: U12.23(START) ; also sheet 1
DAPI_N: D1.C IC13.6(D-) ; also sheet 2
DAPI_P: D2.C IC13.5(D+) ; also sheet 2
DAPI_RX: D4.C IC13.2(TX) ; also sheet 1
DAPI_TX: D3.C IC13.3(RX) ; also sheet 1
EXP_IN: D5.C IC5.2(RO) IC8.1(A1)
EXP_IN_N: IC5.7(B) R15.1 R17.2 ; also sheet 2
EXP_IN_OPT: D10.C IC8.8(COL1) R13.1 ; also sheet 1
EXP_IN_P: IC5.8(A) R10.2 R16.2 ; also sheet 2
EXP_OUT: D6.C IC5.3(DI) IC8.6(COL2) R14.1
EXP_OUT_N: IC5.6(Z) ; also sheet 2
EXP_OUT_OPT: IC8.3(A2) ; also sheet 1
EXP_OUT_P: IC5.5(Y) ; also sheet 2
FL_1_CS1: U7.7(CS1) ; also sheet 1
FL_1_CS2: U7.6(CS2) ; also sheet 1
FL_1_HLD: U7.1(HOLD) ; also sheet 1
FL_1_RES: U7.3(RESET) ; also sheet 1
FL_1_WP: U7.9(WP) ; also sheet 1
FL_2_CS1: U8.7(CS1) ; also sheet 1
FL_2_CS2: U8.6(CS2) ; also sheet 1
FL_2_HLD: U8.1(HOLD) ; also sheet 1
FL_2_RES: U8.3(RESET) ; also sheet 1
FL_2_WP: U8.9(WP) ; also sheet 1
GND: C1.2 C2.2 C3.1 C4.1 C5.- C6.1 C7.- C8.1 C9.1 C10.- C11.- C12.1 C13.1 C14.1 C15.- C19.2 C20.2 C21.2 C22.2 C23.2 C24.2 C25.2 C26.2 C27.2 C28.2 C29.2 C30.2 C31.2 C32.2 C33.2 C35.1 C36.1 C37.1 C39.- C40.- C41.- C45.2 C46.2 C47.2 C48.2 C49.2 C50.2 C52.1 C53.2 C54.1 C55.1 C57.1 C58.1 D1.A D2.A D3.A D4.A D7.A D8.A D9.A D10.A D11.A D12.A IC1.5(-VOUT) IC2.11(P:V-) IC3.11(P:V-) IC4.11(P:V-) IC6.5(EMT2) IC6.7(EMT1) IC7.5(EMT2) IC7.7(EMT1) IC8.7(EMT1) IC9.11(P:V-) IC10.11(P:V-) IC13.1(GND) R2.1 R6.1 R12.1 R23.1 RN2.5 RN2.6 RN2.7 RN2.8 RN5.5 RN5.6 RN5.7 RN5.8 RN8.5 RN8.6 RN8.7 RN8.8 RN14.5 RN14.6 RN14.7 RN14.8 RN17.5 RN17.6 RN17.7 RN17.8 U1.2(GND) U2.2(GND) U3.2(DGND/DSS) U3.3(CLK) U3.10(VREFCOM) U3.21(AVSS) U4.2(DGND/DSS) U4.3(CLK) U4.10(VREFCOM) U4.21(AVSS) U5.2(DGND/DSS) U5.3(CLK) U5.10(VREFCOM) U5.21(AVSS) U6.3(GND) U6.6(GND) U7.10(VSS) U8.10(VSS) U10.2(DGND/DSS) U10.3(CLK) U10.10(VREFCOM) U10.21(AVSS) U11.2(DGND/DSS) U11.3(CLK) U11.10(VREFCOM) U11.21(AVSS) U12.2(DGND/DSS) U12.3(CLK) U12.10(VREFCOM) U12.21(AVSS) U13.2(GND) ; supply symbol labelled SUP ; also sheet 1,2,4
IN_DMS_1: IC2.2(A:-IN) RN3.4 ; also sheet 2
IN_DMS_2: IC2.6(B:-IN) RN3.3 ; also sheet 2
IN_DMS_3: IC2.9(C:-IN) RN3.2 ; also sheet 2
IN_DMS_4: IC2.13(D:-IN) RN3.1 ; also sheet 2
IN_DMS_5: IC3.2(A:-IN) RN6.4 ; also sheet 2
IN_DMS_6: IC3.6(B:-IN) RN6.3 ; also sheet 2
IN_DMS_7: IC9.2(A:-IN) RN15.4 ; also sheet 2
IN_DMS_7_NC: IC3.9(C:-IN) RN6.2
IN_DMS_8: IC9.6(B:-IN) RN15.3 ; also sheet 2
IN_DMS_8_NC: IC3.13(D:-IN) RN6.1
IN_DMS_9: IC9.9(C:-IN) RN15.2 ; also sheet 2
IN_DMS_10: IC9.13(D:-IN) RN15.1 ; also sheet 2
IN_DMS_11: IC10.2(A:-IN) RN18.4 ; also sheet 2
IN_DMS_12: IC10.6(B:-IN) RN18.3 ; also sheet 2
IN_PT_1: IC4.2(A:-IN) RN9.4 ; also sheet 2
IN_PT_2: IC4.6(B:-IN) RN9.3 ; also sheet 2
IN_PT_3: IC4.9(C:-IN) RN9.2 ; also sheet 2
IN_PT_4_NC: IC4.13(D:-IN) RN9.1
INTERSPU_RX: D11.C ; also sheet 1,2
INTERSPU_TX: D12.C ; also sheet 1,2
LO: IC7.2(C1) ; also sheet 2
LO_OPT: D7.C IC7.8(COL1) RN12.6 ; also sheet 1
N$1: C2.1 IC13.8(XO) Q1.2
N$3: C1.1 IC13.7(XI) Q1.1
N$4: R1.2 R3.1 R4.2
N$5: R1.1 U1.5(TRIM)
N$6: R2.2 R4.1
N$7: IC2.3(A:+IN) RN1.5 RN2.4
N$9: IC2.5(B:+IN) RN1.6 RN2.3
N$14: IC2.10(C:+IN) RN1.7 RN2.2
N$15: IC2.12(D:+IN) RN1.8 RN2.1
N$16: C3.2 C5.+ IC2.4(P:V+) L1.2
N$17: IC3.3(A:+IN) RN4.5 RN5.4
N$18: IC3.5(B:+IN) RN4.6 RN5.3
N$19: IC3.10(C:+IN) RN4.7 RN5.2
N$20: IC3.12(D:+IN) RN4.8 RN5.1
N$21: C6.2 C10.+ IC3.4(P:V+) L2.2
N$22: R5.1 U2.5(TRIM)
N$23: R5.2 R7.1 R8.2
N$24: R6.2 R8.1
N$25: IC4.3(A:+IN) RN7.5 RN8.4
N$26: IC4.5(B:+IN) RN7.6 RN8.3
N$27: IC4.10(C:+IN) RN7.7 RN8.2
N$28: IC4.12(D:+IN) RN7.8 RN8.1
N$29: C13.2 C15.+ IC4.4(P:V+) L3.2
N$39: C21.1 U3.9(VREFOUT)
N$40: C24.1 U4.9(VREFOUT)
N$41: C27.1 U5.9(VREFOUT)
N$42: IC6.1(A1) RN11.6
N$43: IC6.3(A2) RN11.5
N$44: IC8.4(C2) R12.2
N$45: IC7.6(COL2) RN12.5
N$46: IC7.1(A1) RN11.8
N$47: IC7.3(A2) RN11.7
N$48: IC7.4(C2)
N$49: IC8.2(C1) R11.2
N$50: C44.1 R10.1 R15.2
N$53: C47.1 U10.9(VREFOUT)
N$54: C50.1 U11.9(VREFOUT)
N$57: C53.1 U12.9(VREFOUT)
N$58: IC9.3(A:+IN) RN13.5 RN14.4
N$59: IC9.5(B:+IN) RN13.6 RN14.3
N$60: IC9.10(C:+IN) RN13.7 RN14.2
N$61: IC9.12(D:+IN) RN13.8 RN14.1
N$62: C54.2 IC9.4(P:V+) L4.2
N$63: IC10.3(A:+IN) RN16.5 RN17.4
N$64: IC10.5(B:+IN) RN16.6 RN17.3
N$65: RN16.7 RN17.2
N$66: RN16.8 RN17.1
N$67: C57.2 IC10.4(P:V+) L5.2
N$68: R22.1 U13.5(TRIM)
N$69: R22.2 R24.1 R25.2
N$70: R23.2 R25.1
OUT_DMS_1: IC2.1(A:OUT) RN3.5 U4.11(AIN0/IEXC)
OUT_DMS_2: IC2.7(B:OUT) RN3.6 U4.17(AIN2/IEXC/GPIO2)
OUT_DMS_3: IC2.8(C:OUT) RN3.7 U3.11(AIN0/IEXC)
OUT_DMS_4: IC2.14(D:OUT) RN3.8 U3.17(AIN2/IEXC/GPIO2)
OUT_DMS_5: IC3.1(A:OUT) RN6.5 U5.11(AIN0/IEXC)
OUT_DMS_6: IC3.7(B:OUT) RN6.6 U5.17(AIN2/IEXC/GPIO2)
OUT_DMS_7: IC9.1(A:OUT) RN15.5 U11.11(AIN0/IEXC)
OUT_DMS_7_NC: IC3.8(C:OUT) RN6.7
OUT_DMS_8: IC9.7(B:OUT) RN15.6 U11.17(AIN2/IEXC/GPIO2)
OUT_DMS_8_NC: IC3.14(D:OUT) RN6.8
OUT_DMS_9: IC9.8(C:OUT) RN15.7 U10.11(AIN0/IEXC)
OUT_DMS_10: IC9.14(D:OUT) RN15.8 U10.17(AIN2/IEXC/GPIO2)
OUT_DMS_11: IC10.1(A:OUT) RN18.5 U12.11(AIN0/IEXC)
OUT_DMS_12: IC10.7(B:OUT) RN18.6 U12.17(AIN2/IEXC/GPIO2)
OUT_PT_1: IC4.1(A:OUT) RN9.5 ; also sheet 1
OUT_PT_2: IC4.7(B:OUT) RN9.6 ; also sheet 1
OUT_PT_3: IC4.8(C:OUT) RN9.7 ; also sheet 1
OUT_PT_4_NC: IC4.14(D:OUT) RN9.8
SODS: IC6.2(C1) ; also sheet 2
SODS_OPT: D8.C IC6.8(COL1) RN12.8 ; also sheet 1
SOE: IC6.4(C2) ; also sheet 2
SOE_OPT: D9.C IC6.6(COL2) RN12.7 ; also sheet 1
SPI2_MISO: U8.8(SO) ; also sheet 1
SPI2_MOSI: U8.15(SI) ; also sheet 1
SPI2_SCK: U8.16(SCK) ; also sheet 1
SPI3_CS: U4.24(!CS) ; also sheet 1
SPI3_CS2: U11.24(!CS) ; also sheet 1
SPI3_MISO: U4.26(DOUT/!DRDY) U11.26(DOUT/!DRDY) ; also sheet 1
SPI3_MOSI: U4.27(DIN) U11.27(DIN) ; also sheet 1
SPI3_SCK: U4.28(SCLK) U11.28(SCLK) ; also sheet 1
SPI4_CS: U3.24(!CS) ; also sheet 1
SPI4_CS2: U10.24(!CS) ; also sheet 1
SPI4_MISO: U3.26(DOUT/!DRDY) U10.26(DOUT/!DRDY) ; also sheet 1
SPI4_MOSI: U3.27(DIN) U10.27(DIN) ; also sheet 1
SPI4_SCK: U3.28(SCLK) U10.28(SCLK) ; also sheet 1
SPI5_CS: U5.24(!CS) ; also sheet 1
SPI5_CS2: U12.24(!CS) ; also sheet 1
SPI5_MISO: U5.26(DOUT/!DRDY) U12.26(DOUT/!DRDY) ; also sheet 1
SPI5_MOSI: U5.27(DIN) U12.27(DIN) ; also sheet 1
SPI5_SCK: U5.28(SCLK) U12.28(SCLK) ; also sheet 1
SPI6_MISO: U7.8(SO) ; also sheet 1
SPI6_MOSI: U7.15(SI) ; also sheet 1
SPI6_SCK: U7.16(SCK) ; also sheet 1
Unconnected: IC1.4(TRIM) IC1.6(RMT_ON_OFF) IC10.8(C:OUT) IC10.9(C:-IN) IC10.10(C:+IN) IC10.12(D:+IN) IC10.13(D:-IN) IC10.14(D:OUT) IC13.4(V3) IC13.9(CTS) IC13.10(DSR) IC13.11(RI) IC13.12(DCD) IC13.13(DTR) IC13.14(RTS) IC13.15(RS232) RN18.1 RN18.2 RN18.7 RN18.8 U3.5(REFP0/GPIO0) U3.6(REFN0/GPIO1) U3.7(REFP1) U3.8(REFN1) U3.12(AIN1/IEXC) U3.13(AIN4/IECG/GPIO4) U3.14(AIN5/IEXC/GPIO5) U3.15(AIN6/IEXC/GPIO6) U3.16(AIN7/IEXC/GPIO7) U3.18(AIN3/IEXC/GPIO3) U3.19(IEXC2) U3.20(IEXC1) U4.5(REFP0/GPIO0) U4.6(REFN0/GPIO1) U4.7(REFP1) U4.8(REFN1) U4.12(AIN1/IEXC) U4.13(AIN4/IECG/GPIO4) U4.14(AIN5/IEXC/GPIO5) U4.15(AIN6/IEXC/GPIO6) U4.16(AIN7/IEXC/GPIO7) U4.18(AIN3/IEXC/GPIO3) U4.19(IEXC2) U4.20(IEXC1) U5.5(REFP0/GPIO0) U5.6(REFN0/GPIO1) U5.7(REFP1) U5.8(REFN1) U5.12(AIN1/IEXC) U5.13(AIN4/IECG/GPIO4) U5.14(AIN5/IEXC/GPIO5) U5.15(AIN6/IEXC/GPIO6) U5.16(AIN7/IEXC/GPIO7) U5.18(AIN3/IEXC/GPIO3) U5.19(IEXC2) U5.20(IEXC1) U10.5(REFP0/GPIO0) U10.6(REFN0/GPIO1) U10.7(REFP1) U10.8(REFN1) U10.12(AIN1/IEXC) U10.13(AIN4/IECG/GPIO4) U10.14(AIN5/IEXC/GPIO5) U10.15(AIN6/IEXC/GPIO6) U10.16(AIN7/IEXC/GPIO7) U10.18(AIN3/IEXC/GPIO3) U10.19(IEXC2) U10.20(IEXC1) U11.5(REFP0/GPIO0) U11.6(REFN0/GPIO1) U11.7(REFP1) U11.8(REFN1) U11.12(AIN1/IEXC) U11.13(AIN4/IECG/GPIO4) U11.14(AIN5/IEXC/GPIO5) U11.15(AIN6/IEXC/GPIO6) U11.16(AIN7/IEXC/GPIO7) U11.18(AIN3/IEXC/GPIO3) U11.19(IEXC2) U11.20(IEXC1) U12.5(REFP0/GPIO0) U12.6(REFN0/GPIO1) U12.7(REFP1) U12.8(REFN1) U12.12(AIN1/IEXC) U12.13(AIN4/IECG/GPIO4) U12.14(AIN5/IEXC/GPIO5) U12.15(AIN6/IEXC/GPIO6) U12.16(AIN7/IEXC/GPIO7) U12.18(AIN3/IEXC/GPIO3) U12.19(IEXC2) U12.20(IEXC1)

### Notes on the sheet
- Ref voltage | logic side    <->  RXSM side
- Opto. isolation | Spike protection | Filter/Buffer caps.
- Feinabgleich
- Feinabgleich
- Feinabgleich
- RS422 driver
- V. Reg
- FLASH  mem
- LM78L05ACMX/NOPB
- USB-
    UART
- FL1 | FL2
- ADCs | all logic sided on this page
- OPAmps

## Sheet 4 of 4: IO/LED
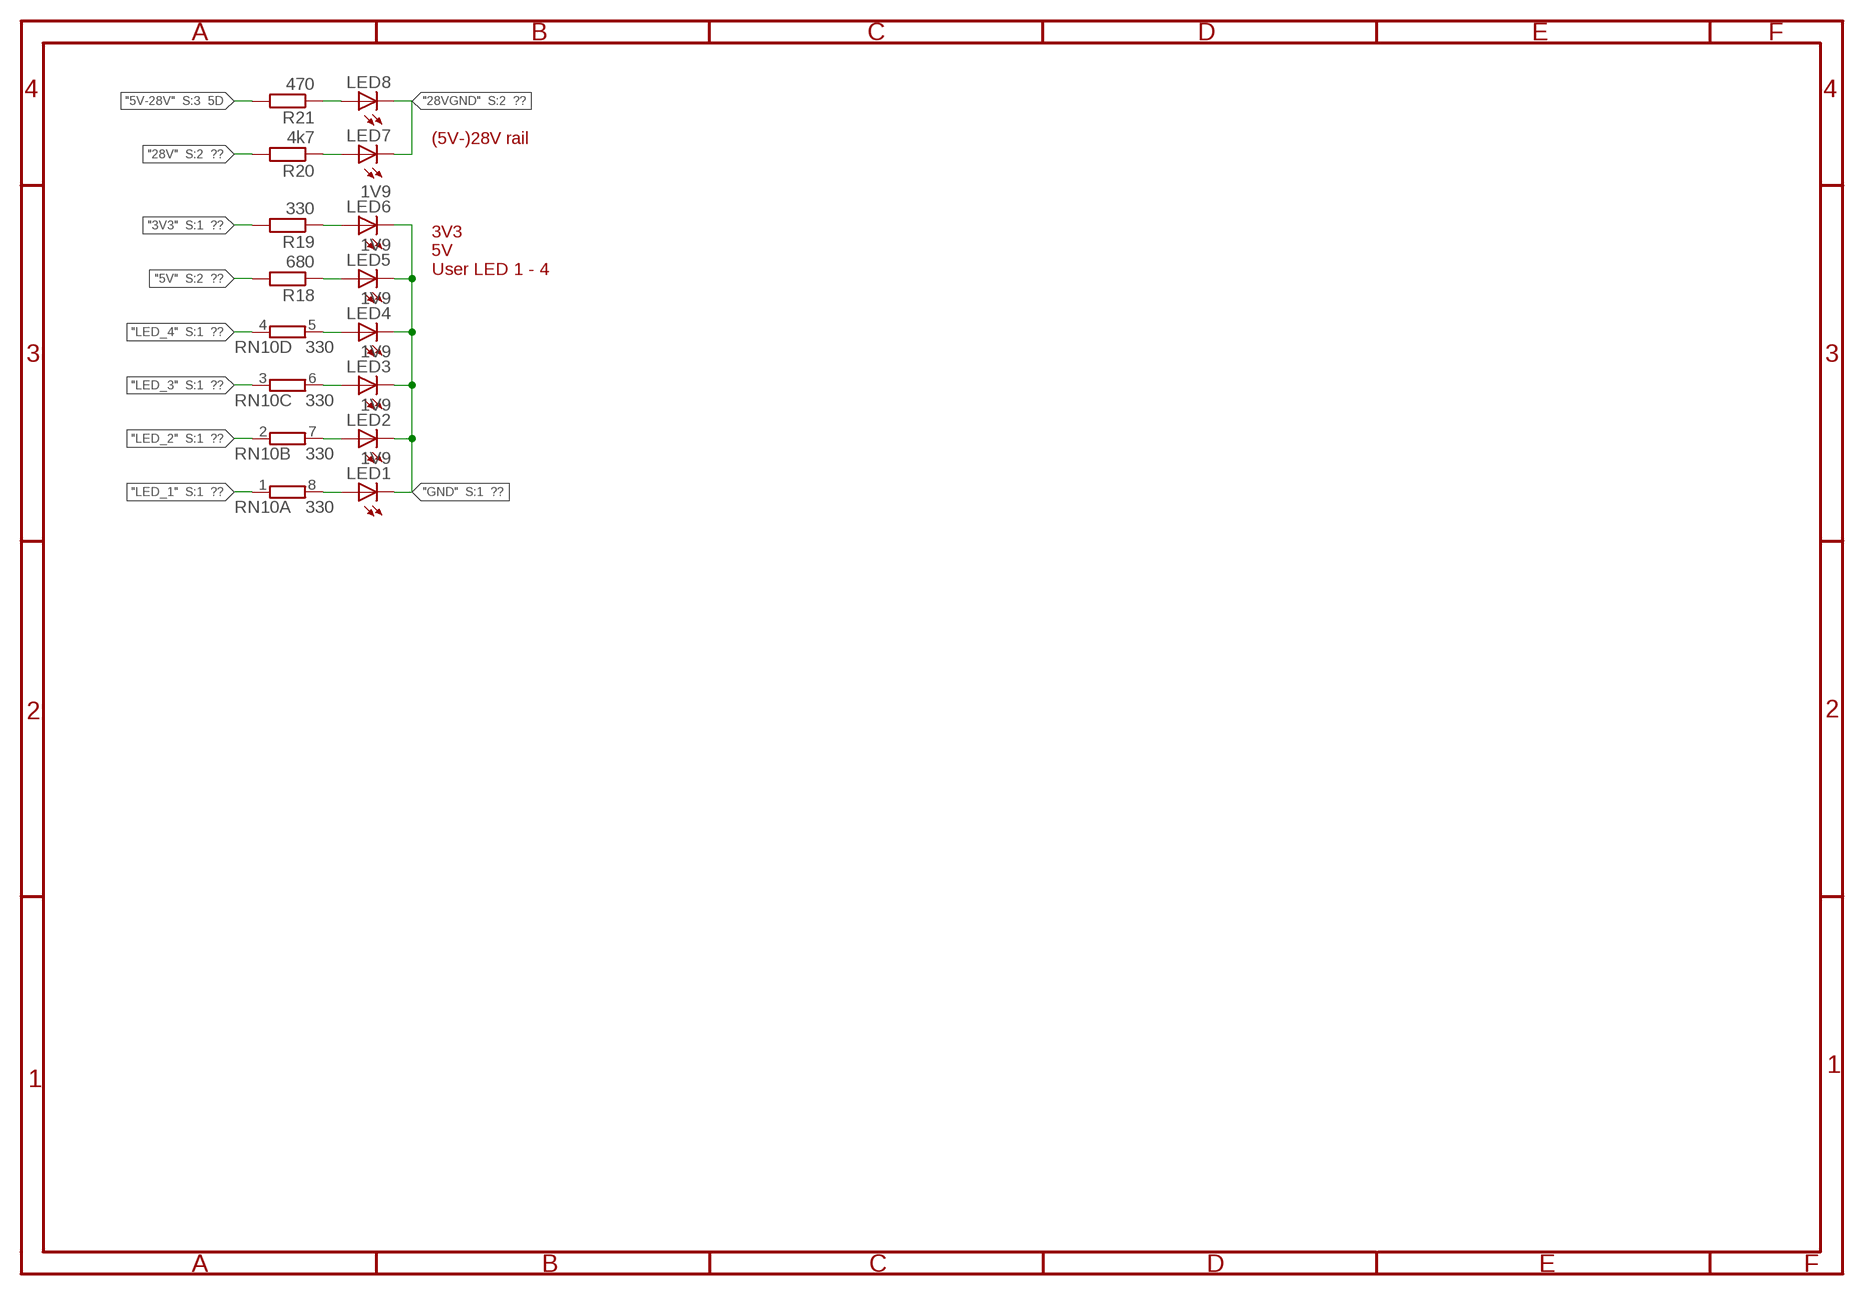
[diagram p7: schematic, sheet 4]

### Parts
LED1  1V9  LEDCHIP-LED0603  [CHIP-LED0603]
LED2  1V9  LEDCHIP-LED0603  [CHIP-LED0603]
LED3  1V9  LEDCHIP-LED0603  [CHIP-LED0603]
LED4  1V9  LEDCHIP-LED0603  [CHIP-LED0603]
LED5  1V9  LEDCHIP-LED0603  [CHIP-LED0603]
LED6  1V9  LEDCHIP-LED0603  [CHIP-LED0603]
LED7  LEDCHIP-LED0603  [CHIP-LED0603]
LED8  LEDCHIP-LED0603  [CHIP-LED0603]
R18  680  R-EU_R0805  [R0805]
R19  330  R-EU_R0805  [R0805]
R20  4k7  R-EU_R0805  [R0805]
R21  470  R-EU_R0805  [R0805]
RN10  330  4R-NEXBS8V  [EXBS8V]

### Nets
3V3: R19.2 ; also sheet 1,2,3
5V: R18.2 ; also sheet 2,3
5V-28V: R21.2 ; also sheet 3
28V: R20.2 ; also sheet 2,3
28VGND: LED7.C LED8.C ; also sheet 2,3
GND: LED1.C LED2.C LED3.C LED4.C LED5.C LED6.C ; also sheet 1,2,3
LED_1: RN10.1 ; also sheet 1
LED_2: RN10.2 ; also sheet 1
LED_3: RN10.3 ; also sheet 1
LED_4: RN10.4 ; also sheet 1
N$30: LED1.A RN10.8
N$31: LED2.A RN10.7
N$32: LED3.A RN10.6
N$33: LED4.A RN10.5
N$51: LED5.A R18.1
N$52: LED6.A R19.1
N$55: LED7.A R20.1
N$56: LED8.A R21.1

### Notes on the sheet
- (5V-)28V rail
  
  
  
  
  3V3
  5V
  User LED 1 - 4

## Library data of the parts
C1 C2 = rcl:C-EU: CAPACITOR, European symbol
C3 C4 C6 C8 C9 C12-C14 C16 C17 C19-C37 C42-C50 C52-C55 C57 C58 = rcl:C-EU: CAPACITOR, European symbol; SPICEPREFIX: C
C5 C7 C10 C11 C15 C38-C41 = rcl:CPOL-EU: POLARIZED CAPACITOR, European symbol; SPICEPREFIX: C
C18 = aSparkFun:CAP: Capacitor Standard 0603 ceramic capacitor, and 0.1" leaded capacitor.
D1-D12 = diodes:DZ: Zener diode
IC1 = traco_thl_tel_series:THL_20WI_SERIES: TRACO POWER DC/DC converter THL 20WI Series created by Mario Blunk - electronics & IT engineering at www.train-z.de; HEAT-SINK: NO
IC2-IC4 IC9 IC10 = linear:MCP604: Quad Op Amp 2.7V to 6.0V Single Supply CMOS Source: http://ww1.microchip.com/downloads/en/DeviceDoc/21314g.pdf
IC5 = maxim:MAX488: RS485 TRANSEIVER Source: Data sheet <http://datasheets.maxim-ic.com/en/ds/MAX1487-MAX491.pdf>; MF: MAXIM; MPN: MAX488CSA; OC_FARNELL: 3534170; OC_NEWARK: 34C3921
IC6-IC8 = Opto-Electronic:MOCD207M: 8- pin SOIC Dual-Channel Phototransistor Output Optocoupler; CATEGORY: Opto-Electronic; MANUFACTURER: ON Semiconductor; MPN: MOCD207M; OPERTAING_TEMP: -40 to +100 °C; PART_STATUS: Active; ROHS_COMPLIANT: RoHS3 Compliant; SUB-CATEGORY: OptoCoupler; THERMALLOSS: 0.24W
IC12 = m-pad-2.1:LM78L05ACMX/NOPB
IC13 = ch340g:CH340G
JP1 = SparkFun-Jumpers:JUMPER-SMT_2_NC_PASTE: Normally closed solder jumper This jumper has an aperture in the stencil to allow solder paste to bridge the split in the wire so it's normally closed (NC). Wick off the solder to open the connection. Reapply solder to reclose the connection.
JP_MS = aSparkFun:M02: Header 2 Standard 2-pin 0.1" header. Use with straight break away headers (SKU : PRT-00116), right angle break away headers (PRT-00553), swiss pins (PRT-00743), machine pins (PRT-00117), and female headers (PRT-00115). Molex polarized connector foot print use with SKU : PRT-08233 with associated crimp pins and housings.
L1-L5 = rcl:L-EU: INDUCTOR, European symbol; SPICEPREFIX: L
LED1-LED8 = adafruit:LED: LED OSRAM: - CHIPLED LG R971, LG N971, LY N971, LG Q971, LY Q971, LO R971, LY R971 LH N974, LH R974 LS Q976, LO Q976, LY Q976 LO Q996 - Hyper CHIPLED LW Q18S LB Q993, LB Q99A, LB R99A - SideLED LS A670, LO A670, LY A670, LG A670, LP A670 LB A673, LV A673, LT A673, LW A673 LH A674 LY A675 LS A676, LA A676, LO A676, LY A676, LW A676 LS A679, LY A679, LG A679 - Hyper Micro SIDELED® LS Y876, LA Y876, LO Y876, LY Y876 LT Y87S - SmartLED LW L88C, LW L88S LB L89C, LB L89S, LG L890 LS L89K, LO L89K, LY L89K LS L896, LA L896, LO L896, LY L896 - TOPLED LS T670, LO T670, LY T670, LG T670, LP T670 LSG T670, LSP T670, LSY T670, LOP T670, LYG T670 LG T671, LOG T671, LSG T671 LB T673, LV T673, LT T673, LW T673 LH T674 LS T676, LA T676, LO T676, LY T676, LB T676, LH T676, LSB T676, LW T676 LB T67C, LV T67C, LT T67C, LS T67K, LO T67K, LY T67K, LW E67C LS E67B, LA E67B, LO E67B, LY E67B, LB E67C, LV E67C, LT E67C LW T67C LS T679, LY T679, LG T679 LS T770, LO T770, LY T770, LG T770, LP T770 LB T773, LV T773, LT T773, LW T773 LH T774 LS E675, LA E675, LY E675, LS T675 LS T776, LA T776, LO T776, LY T776, LB T776 LHGB T686 LT T68C, LB T68C - Hyper Mini TOPLED® LB M676 - Mini TOPLED Santana® LG M470 LS M47K, LO M47K, LY M47K Source: http://www.osram.convergy.de/
Q1 = adafruit:CRYSTAL: CRYSTAL; OC_FARNELL: unknown; OC_NEWARK: unknown
R1-R9 R11-R14 R18-R29 = rcl:R-EU_: RESISTOR, European symbol; SPICEPREFIX: R
R10 R15-R17 = rcl:R-EU_: RESISTOR, European symbol
RN1-RN18 = resistor-dil:4R-N: Array Chip Resistor Source: RS Component / Phycomp; OC_FARNELL: unknown; OC_NEWARK: unknown
SJ_MS = aSparkFun:SOLDERJUMPER: Solder Jumper Standard SMD solder jumper. Used to automate production. Two varients : Normally Open and Normally Closed are the same, but have different paste layers. NC will have a large amount of paste and should jumper during reflow.
U1 U2 U13 = ADR360:ADR36*: ADR360 (ADR360 ADR361 ADR363 ADR364 ADR365 ADR366 A|B UJZ) 5-Lead TSOT Low Power, Low Noise, Band Gap Voltage References Analog Devices Source: www.analog.com Technologies / Packages ADR36n A|B UJZ n Output-Voltage: 0 = 2.048V | 1 = 2.500 V | 3 = 3.000 V | 4 = 4.096 V | 5 = 5.000 V | 6 = 3.300 V A|B Grade: A = 25 ppm/K; +-6 mV max. | B = 9 ppm/K; +- 3mV max. UJZ Package: 5-Lead TSOT, RoHS-compliant Vin = 15 (18) V, Vdrop = 300 mV, Iout = +5 mA / -1mA Author: Dipl.-Ing. FH Rainer Bayer HHN Hochschule Heilbronn, rainer.bayer@hs-heilbronn.de Ingenieurbüro ing-rb, mail@ing-rb.de
U3-U5 U10-U12 = ads11xx:ADS1148QPWRQ1
U6 = aSparkFun:LT1528: LT1528 High current voltage regulator commonly used with GM862 cellular module. Spark Fun Electronics SKU : COM-00311. Footprint may need to have the large paste aperature reduced.
U7 U8 = S70FL01GS:S70FL01GS
U9 = stm32f:STM32F77XXX
X1 = con-thomas-betts:D-SUB9-: D-Subminiatur Connector Source: Electronioc Interconnects European Edition 1998; OC_FARNELL: unknown; OC_NEWARK: unknown
X2 = con-thomas-betts:D-SUB15-: D-Subminiatur Connector Source: Electronioc Interconnects European Edition 1998; MF: TYCO ELECTRONICS; MPN: H5M15RA29C; OC_FARNELL: unknown; OC_NEWARK: 93F8315
X3 = aSparkFun:USB: USB Connectors USB-B-PTH is fully proven SKU : PRT-00139 USB-miniB is fully proven SKU : PRT-00587 USB-A-PCB is untested. USB-A-H is throughly reviewed, but untested. Spark Fun Electronics SKU : PRT-00437 USB-B-SMT is throughly reviewed, but untested. Needs silkscreen touching up. USB-A-S has not been used/tested USB-MB-H has not been used/tested
X_IN_1-X_IN_15 = adafruit:SMACONNECTOR: SMA Connector 90° DIP SMA Connector, 50 Ohm (4UConnector: 07259)
X_PROG = con-lstb:MA07-2: PIN HEADER; OC_FARNELL: unknown; OC_NEWARK: unknown